# EasyEDA Pro project ProProject_circuller_2023-11-15.epro

# Schematic Schematic1
Create Date: 2023-10-07; Page Name: P1; Project Name: circuller; Schematic Name: Schematic1; Update Date: 2023-10-11; Company: MPAM Lab; Page Size: A3; Version: 0.1
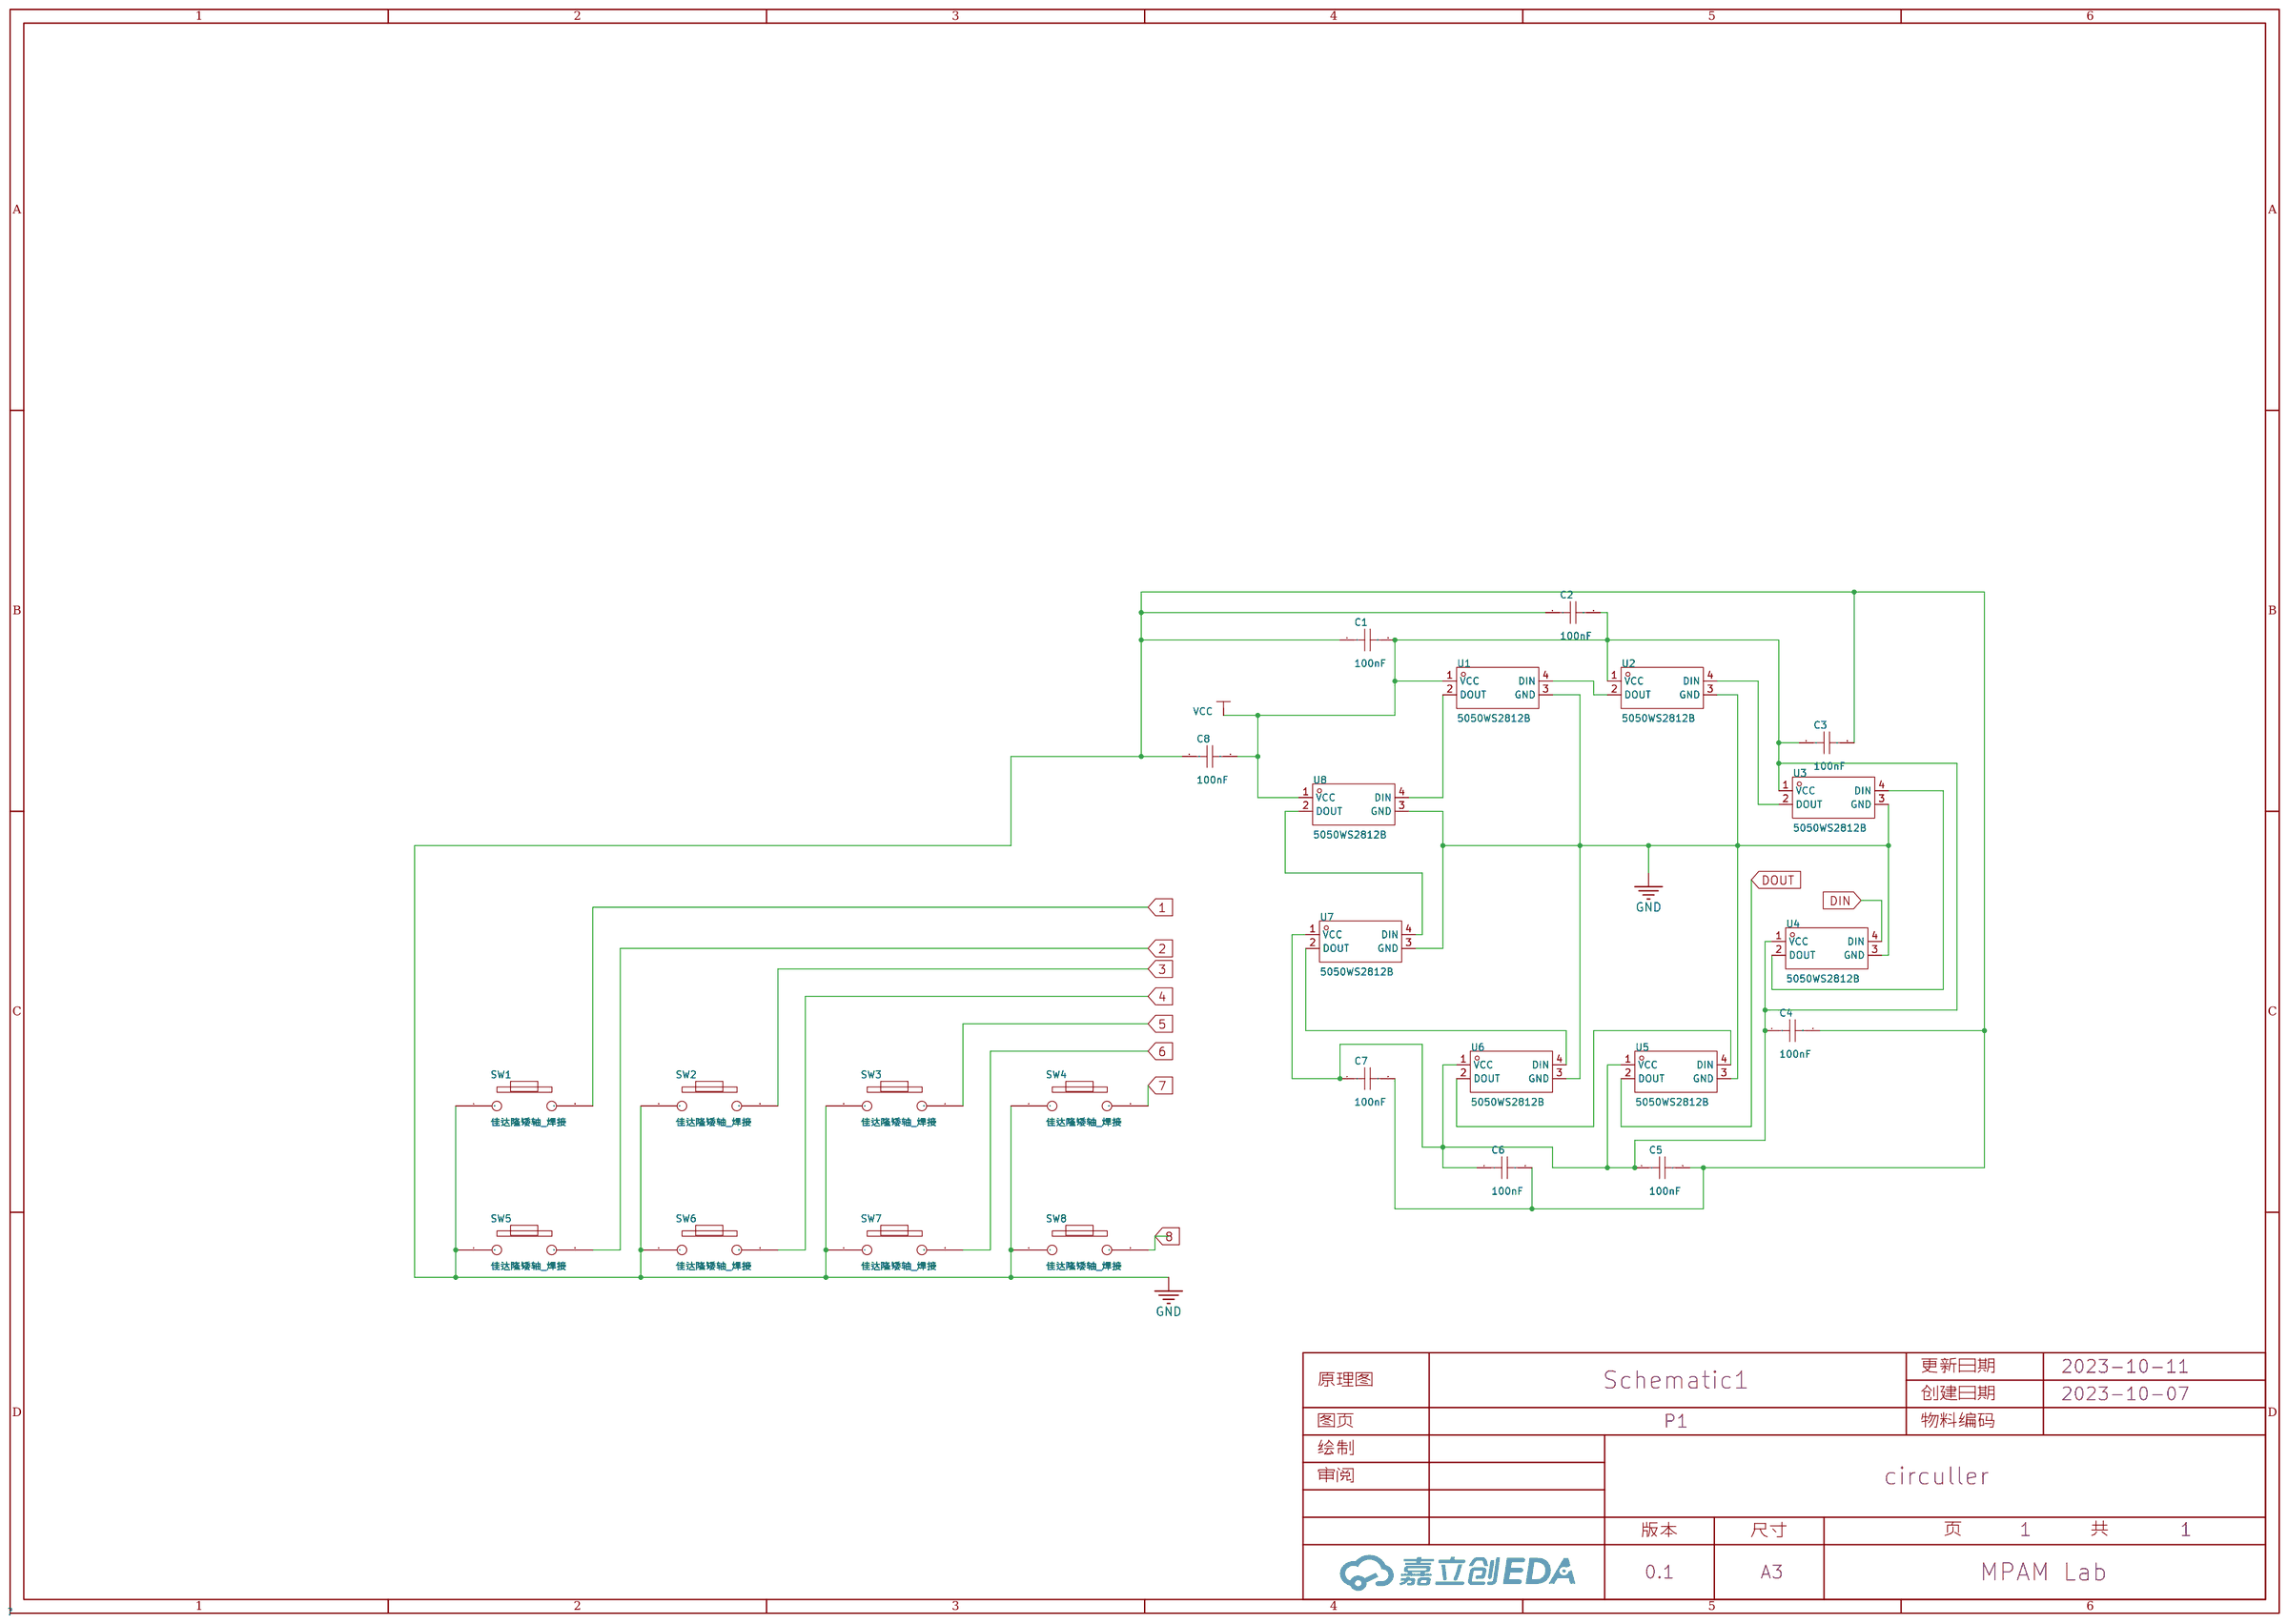
[diagram p0: schematic sheet]

## Parts
C1  100nF  [C0603]
C2  100nF  [C0603]
C3  100nF  [C0603]
C4  100nF  [C0603]
C5  100nF  [C0603]
C6  100nF  [C0603]
C7  100nF  [C0603]
C8  100nF  [C0603]
SW1  佳达隆矮轴_焊接  [佳达隆矮轴焊接]
SW2  佳达隆矮轴_焊接  [佳达隆矮轴焊接]
SW3  佳达隆矮轴_焊接  [佳达隆矮轴焊接]
SW4  佳达隆矮轴_焊接  [佳达隆矮轴焊接]
SW5  佳达隆矮轴_焊接  [佳达隆矮轴焊接]
SW6  佳达隆矮轴_焊接  [佳达隆矮轴焊接]
SW7  佳达隆矮轴_焊接  [佳达隆矮轴焊接]
SW8  佳达隆矮轴_焊接  [佳达隆矮轴焊接]
U1  5050WS2812B  [LED-SMD_5050WS2812B]
U2  5050WS2812B  [LED-SMD_5050WS2812B]
U3  5050WS2812B  [LED-SMD_5050WS2812B]
U4  5050WS2812B  [LED-SMD_5050WS2812B]
U5  5050WS2812B  [LED-SMD_5050WS2812B]
U6  5050WS2812B  [LED-SMD_5050WS2812B]
U7  5050WS2812B  [LED-SMD_5050WS2812B]
U8  5050WS2812B  [LED-SMD_5050WS2812B]

## Library data of the parts
C1-C8 = CAP_0603: Supplier Footprint: 0603
SW1-SW8 = 佳达隆矮轴_焊接: Supplier: eyy
U1-U8 = 5050WS2812B: Supplier Part: C2874876; Supplier Footprint: LED-SMD-4_L5.0-W5.0-P3.20-LS5.4; JLCPCB Part Class: 扩展库; Datasheet: 2021-08-01/763763S/fc73e402754744b5b9326c8825dec5cc/ws2812B.pdf; Supplier: LCSC

## Nets
GND: C1.1 C2.1 C3.2 C4.2 C5.2 C6.2 C7.2 C8.1 SW1.1 SW2.1 SW3.1 SW4.1 SW5.1 SW6.1 SW7.1 SW8.1 U1.3(GND) U2.3(GND) U3.3(GND) U4.3(GND) U5.3(GND) U6.3(GND) U7.3(GND) U8.3(GND)
VCC: C1.2 C2.2 C3.1 C4.1 C5.1 C6.1 C7.1 C8.2 U1.1(VCC) U2.1(VCC) U3.1(VCC) U4.1(VCC) U5.1(VCC) U6.1(VCC) U7.1(VCC) U8.1(VCC)
1: SW1.2
2: SW5.2
3: SW2.2
4: SW6.2
5: SW3.2
6: SW7.2
7: SW4.2
8: SW8.2
DIN: U4.4(DIN)
DOUT: U5.2(DOUT)
$1N1699: U1.2(DOUT) U8.4(DIN)
$1N1729: U1.4(DIN) U2.2(DOUT)
$1N1734: U2.4(DIN) U3.2(DOUT)
$1N1800: U3.4(DIN) U4.2(DOUT)
$1N1842: U6.4(DIN) U7.2(DOUT)
$1N1852: U5.4(DIN) U6.2(DOUT)
$1N6884: U7.4(DIN) U8.2(DOUT)

# Schematic Ver 2
Create Date: 2023-11-13; Page Name: P1; Project Name: circuller; Schematic Name: Ver 2; Update Date: 2023-11-14; Company: MPAM Laboratory; Drawed: FDS; Page Size: A4; Part Number: M-CIR-PCB-1; Reviewed: FDS; Version: V1.0
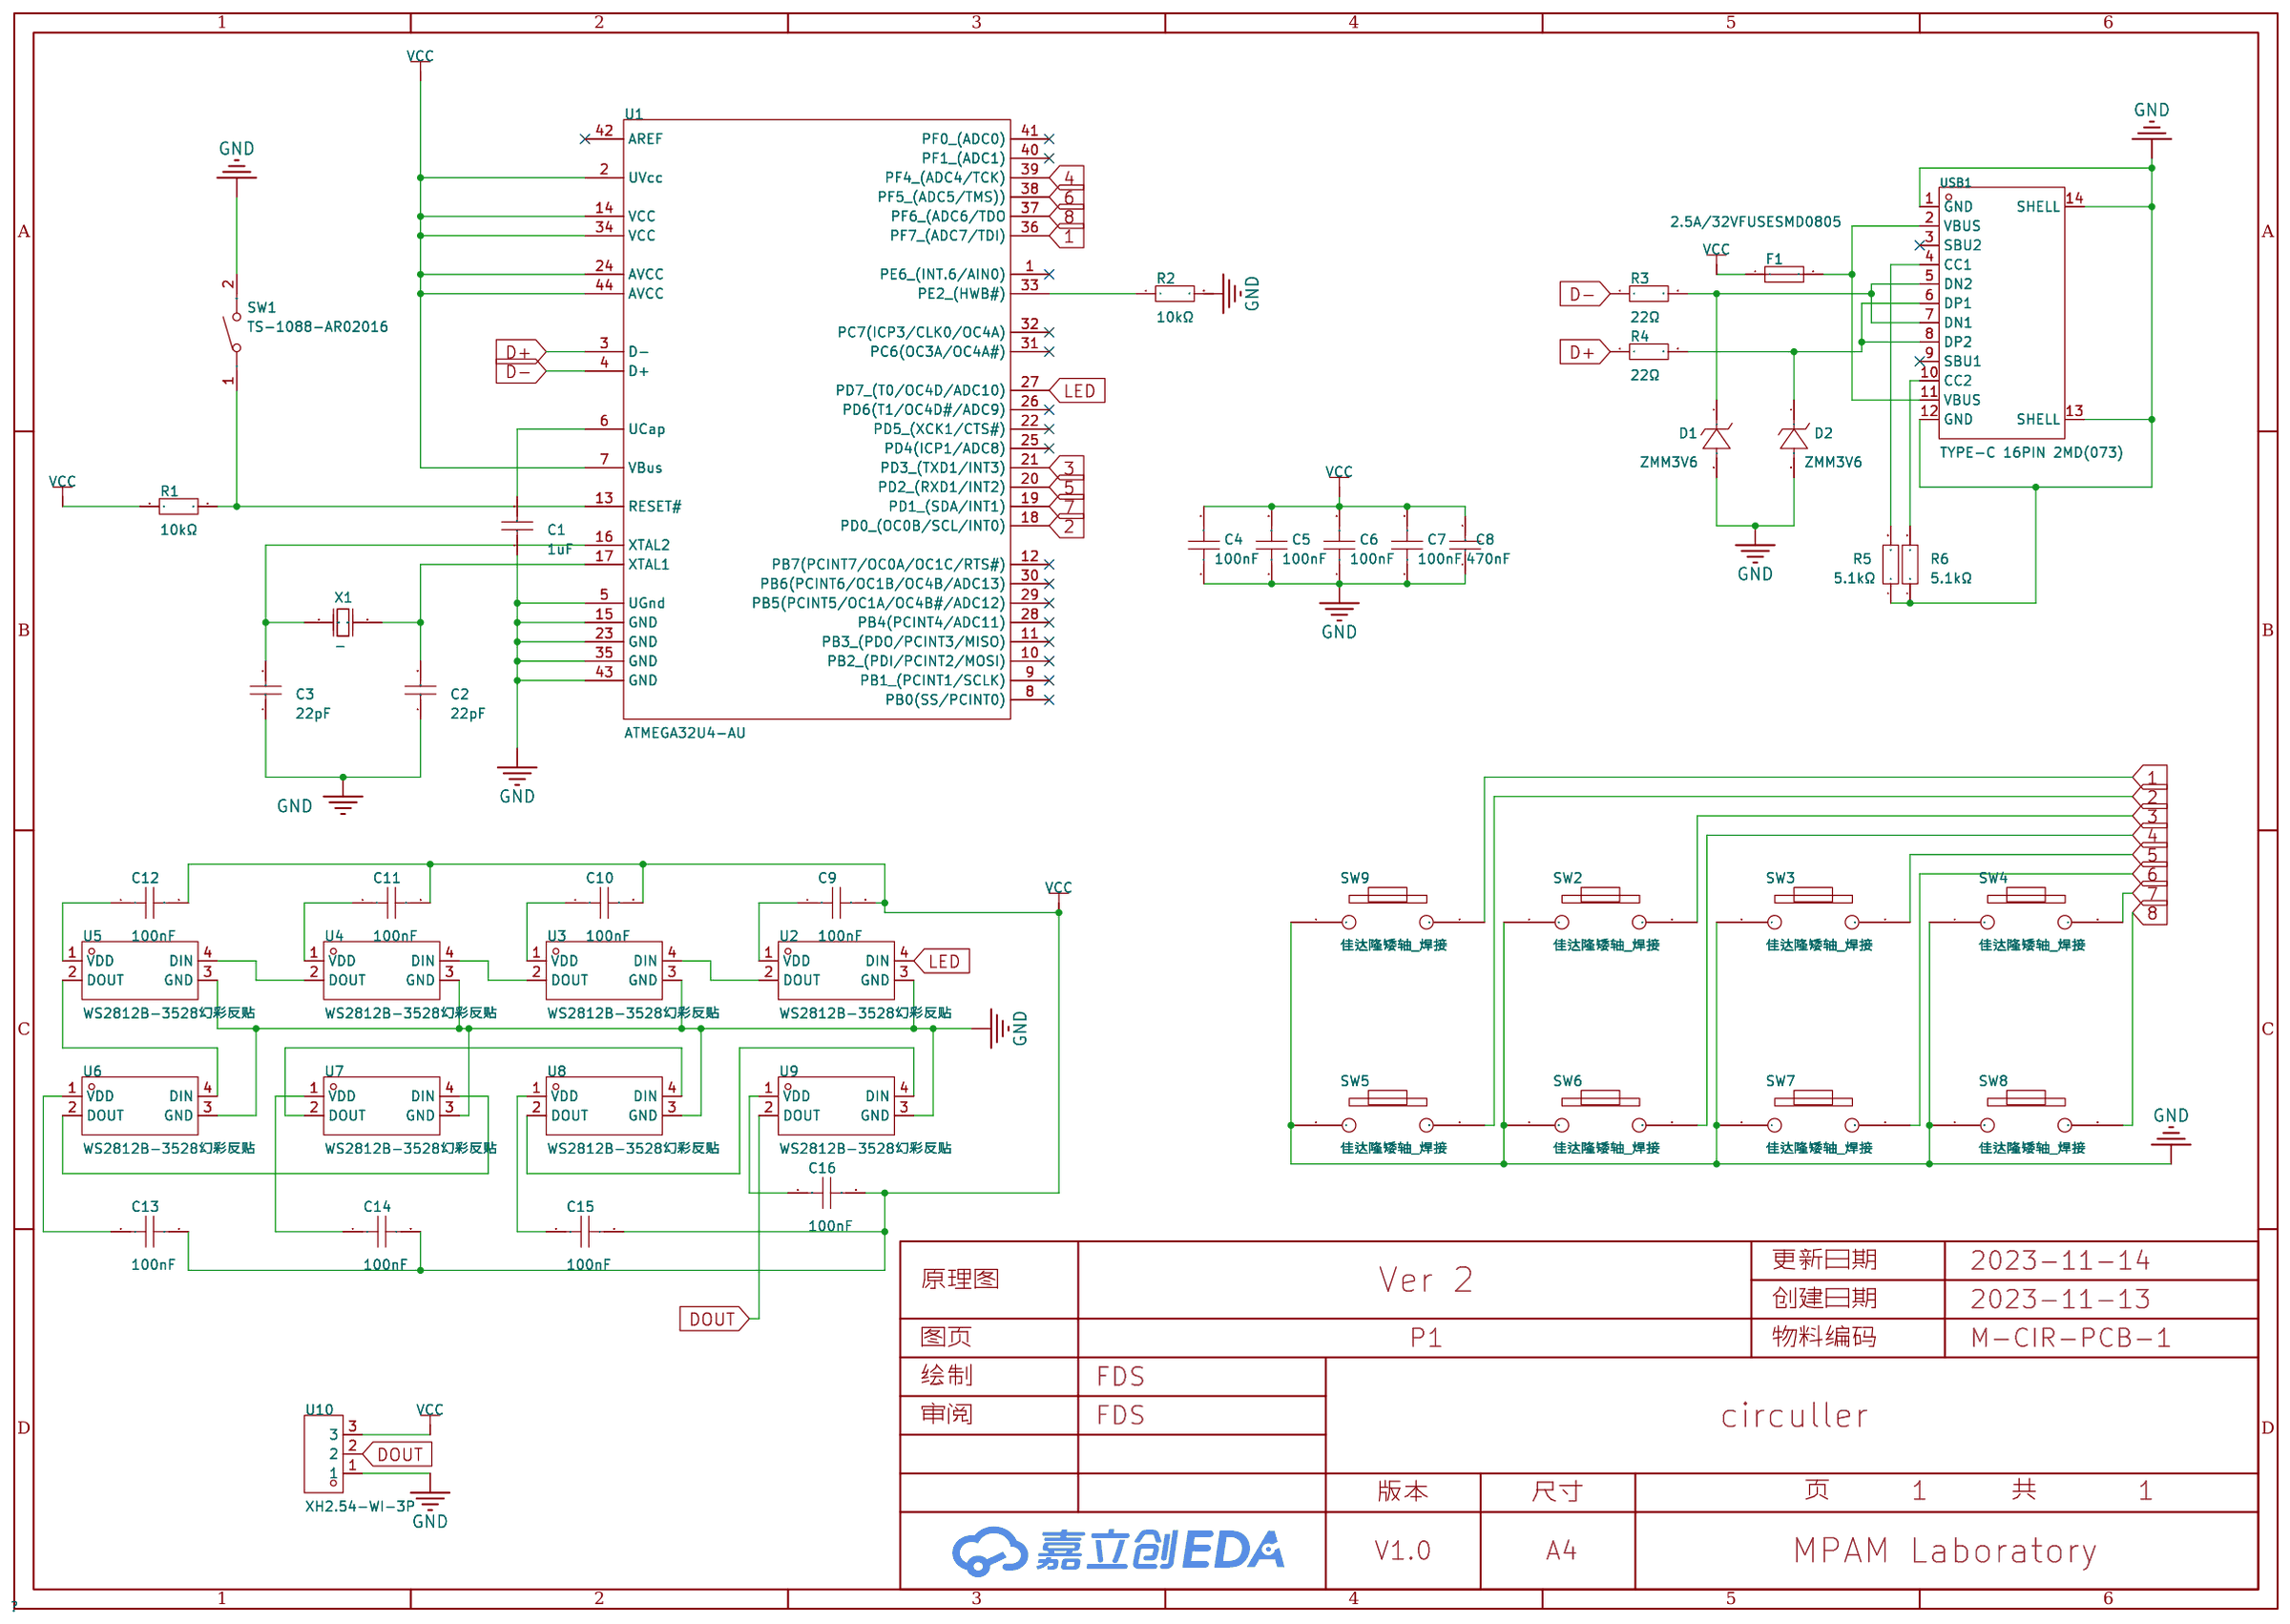
[diagram p1: schematic sheet]

## Parts
C1  1uF  [C0603]
C2  22pF  [C0603]
C3  22pF  [C0603]
C4  100nF  [C0603]
C5  100nF  [C0603]
C6  100nF  [C0603]
C7  100nF  [C0603]
C8  470nF  [C0603]
C9  100nF  [C0603]
C10  100nF  [C0603]
C11  100nF  [C0603]
C12  100nF  [C0603]
C13  100nF  [C0603]
C14  100nF  [C0603]
C15  100nF  [C0603]
C16  100nF  [C0603]
D1  ZMM3V6  [LL-34_L3.5-W1.5-RD]
D2  ZMM3V6  [LL-34_L3.5-W1.5-RD]
F1  2.5A/32VFUSESMD0805  [F0805]
R1  10kΩ  [R0603]
R2  10kΩ  [R0603]
R3  22Ω  [R0603]
R4  22Ω  [R0603]
R5  5.1kΩ  [R0603]
R6  5.1kΩ  [R0603]
SW1  TS-1088-AR02016  [SW-SMD_L3.9-W3.0-P4.45]
SW2  佳达隆矮轴_焊接  [佳达隆矮轴焊接]
SW3  佳达隆矮轴_焊接  [佳达隆矮轴焊接]
SW4  佳达隆矮轴_焊接  [佳达隆矮轴焊接]
SW5  佳达隆矮轴_焊接  [佳达隆矮轴焊接]
SW6  佳达隆矮轴_焊接  [佳达隆矮轴焊接]
SW7  佳达隆矮轴_焊接  [佳达隆矮轴焊接]
SW8  佳达隆矮轴_焊接  [佳达隆矮轴焊接]
SW9  佳达隆矮轴_焊接  [佳达隆矮轴焊接]
U1  ATMEGA32U4-AU  [QFP-44_L10.0-W10.0-P0.80-LS13.2-BL]
U2  WS2812B-3528幻彩反贴  [LED-SMD_L3.2-W2.8-TR]
U3  WS2812B-3528幻彩反贴  [LED-SMD_L3.2-W2.8-TR]
U4  WS2812B-3528幻彩反贴  [LED-SMD_L3.2-W2.8-TR]
U5  WS2812B-3528幻彩反贴  [LED-SMD_L3.2-W2.8-TR]
U6  WS2812B-3528幻彩反贴  [LED-SMD_L3.2-W2.8-TR]
U7  WS2812B-3528幻彩反贴  [LED-SMD_L3.2-W2.8-TR]
U8  WS2812B-3528幻彩反贴  [LED-SMD_L3.2-W2.8-TR]
U9  WS2812B-3528幻彩反贴  [LED-SMD_L3.2-W2.8-TR]
U10  XH2.54-WI-3P  [CONN-TH_XH2.54-WI-3P]
USB1  TYPE-C 16PIN 2MD(073)  [USB-C-SMD_TYPE-C-6PIN-2MD-073]
X1  -  [OSC-SMD_2P-L5.0-W3.2]

## Library data of the parts
C1 = CL10A105KB8NNNC: 容值:1uF;精度:±10%;额定电压:50V;材质(温度系数):X5R;; LCSC Part Name: 1uF ±10% 50V; Supplier Part: C15849; Manufacturer: SAMSUNG(三星); Supplier Footprint: 0603; JLCPCB Part Class: 基础库; Datasheet: https://atta.szlcsc.com/upload/public/pdf/source/20160103/1457707679084.pdf; Supplier: LCSC; Tolerance: ±10%; Voltage Rated: 50V; Temperature Coefficient: X5R
C2 C3 = CL10C220JB8NNNC: 容值:22pF;精度:±5%;额定电压:50V;材质(温度系数):C0G;; LCSC Part Name: 22pF ±5% 50V; Supplier Part: C1653; Manufacturer: SAMSUNG(三星); Supplier Footprint: 0603; JLCPCB Part Class: 基础库; Datasheet: https://atta.szlcsc.com/upload/public/pdf/source/20160218/1457707763339.pdf; Supplier: LCSC; Tolerance: ±5%; Voltage Rated: 50V; Temperature Coefficient: C0G
C4-C7 = CC0603KRX7R9BB104: 容值:100nF;精度:±10%;额定电压:50V;材质(温度系数):X7R;; LCSC Part Name: 100nF ±10% 50V; Supplier Part: C14663; Manufacturer: YAGEO(国巨); Supplier Footprint: 0603; JLCPCB Part Class: 基础库; Datasheet: https://atta.szlcsc.com/upload/public/pdf/source/20180910/C282072_33301C7F631E79921B82A8DAC6BCC5B3.pdf; Supplier: LCSC; Tolerance: ±10%; Voltage Rated: 50V; Temperature Coefficient: X7R
C8 = CL10B474KA8NNNC: 容值:470nF;精度:±10%;额定电压:25V;材质(温度系数):X7R;; LCSC Part Name: 470nF ±10% 25V; Supplier Part: C1623; Manufacturer: SAMSUNG(三星); Supplier Footprint: 0603; JLCPCB Part Class: 基础库; Datasheet: https://atta.szlcsc.com/upload/public/pdf/source/20160218/1457707763339.pdf; Supplier: LCSC; Tolerance: ±10%; Voltage Rated: 25V; Temperature Coefficient: X7R
C9-C16 = CC0603KRX7R9BB104: 容值:100nF;精度:±10%;额定电压:50V;材质(温度系数):X7R;; LCSC Part Name: 100nF ±10% 50V; Supplier Part: C14663; Manufacturer: YAGEO(国巨); Supplier Footprint: 0603; JLCPCB Part Class: Basic Part; Datasheet: https://atta.szlcsc.com/upload/public/pdf/source/20180910/C282072_33301C7F631E79921B82A8DAC6BCC5B3.pdf; Supplier: LCSC; Tolerance: ±10%; Voltage Rated: 50V; Temperature Coefficient: X7R; Check: true
D1 D2 = ZMM3V6: 稳压值(标称值):-;精度:-;功率:500mW;反向电流(Ir):2uA@1V;; LCSC Part Name: 500mW; Supplier Part: C707190; Manufacturer: Slkor(萨科微); Supplier Footprint: LL-34; JLCPCB Part Class: 扩展库; Datasheet: https://atta.szlcsc.com/upload/public/pdf/source/20200721/C707184_776B95022AAA01ECB528B9CFDAFDB27C.pdf; Supplier: LCSC; Power Dissipation: 500mW; Reverse Leakage Current (Ir): 2uA@1V
F1 = 2.5A/32VFUSESMD0805: Supplier Part: C9900004266; JLCPCB Part Class: 扩展库; Datasheet: https://atta.szlcsc.comnull; Supplier: LCSC
R1 R2 = 0603WAF1002T5E: 电阻类型:厚膜电阻;阻值:10kΩ;精度:±1%;功率:100mW;; LCSC Part Name: 厚膜电阻 10kΩ ±1% 100mW; Supplier Part: C25804; Manufacturer: UNI-ROYAL(厚声); Supplier Footprint: 0603; JLCPCB Part Class: 基础库; Datasheet: https://atta.szlcsc.com/upload/public/pdf/source/20200306/C422600_1E6D84923E4A46A82E41ADD87F860B5C.pdf; Supplier: LCSC; Type: 厚膜电阻; Tolerance: ±1%; Power(Watts): 100mW; Temperature Coefficient: ±100ppm/℃; Overload Voltage (Max): 75V; Operating Temperature Range: -55℃~+155℃
R3 R4 = 0603WAF220JT5E: 电阻类型:厚膜电阻;阻值:22Ω;精度:±1%;功率:100mW;温度系数:±100ppm/℃;; LCSC Part Name: 厚膜电阻 22Ω ±1% 100mW; Supplier Part: C23345; Manufacturer: UNI-ROYAL(厚声); Supplier Footprint: 0603; JLCPCB Part Class: 基础库; Datasheet: https://atta.szlcsc.com/upload/public/pdf/source/20200306/C422600_1E6D84923E4A46A82E41ADD87F860B5C.pdf; Supplier: LCSC; Type: 厚膜电阻; Tolerance: ±1%; Power(Watts): 100mW; Temperature Coefficient: ±100ppm/℃; Overload Voltage (Max): 75V; Operating Temperature Range: -55℃~+155℃
R5 R6 = 0603WAF5101T5E: 电阻类型:厚膜电阻;阻值:5.1kΩ;精度:±1%;功率:100mW;温度系数:±100ppm/℃;; LCSC Part Name: 厚膜电阻 5.1kΩ ±1% 100mW; Supplier Part: C23186; Manufacturer: UNI-ROYAL(厚声); Supplier Footprint: 0603; JLCPCB Part Class: 基础库; Datasheet: https://atta.szlcsc.com/upload/public/pdf/source/20200306/C422600_1E6D84923E4A46A82E41ADD87F860B5C.pdf; Supplier: LCSC; Type: 厚膜电阻; Tolerance: ±1%; Power(Watts): 100mW; Temperature Coefficient: ±100ppm/℃; Overload Voltage (Max): 75V; Operating Temperature Range: -55℃~+155℃
SW1 = TS-1088-AR02016: 触点电流:50mA;额定电压(DC):12V;绝缘电阻:100MΩ;电路结构:单刀单掷;安装方式:立贴;作用力:160gf@±50gf;机械寿命:10万次;带支架:否;; LCSC Part Name: 4*3*2mm 立贴 轻触开关; Supplier Part: C720477; Manufacturer: XUNPU(讯普); Supplier Footprint: SMD; JLCPCB Part Class: 扩展库; Datasheet: https://atta.szlcsc.com/upload/public/pdf/source/20200810/C720475_60D09DD6C54279ADDB2DC25100F1CC11.pdf; Supplier: LCSC; Contact Current: 50mA; Voltage Rating (DC): 12V; Insulation Resistance: 100MΩ; Circuit: 单刀单掷; Mounting Style: 立贴; Actuator Style: 圆形按钮; Actuator/Cap Color: 黑色; Operating Force: 160gf@±50gf; Mechanical Life: 10万次; Operating Temperature: -30℃~+80℃; Pin Style: SMD接片; Switch Length: 4mm; Switch Width: 3mm; Switch Height: 2mm; Strike Gundam: 否
SW2-SW9 = 佳达隆矮轴_焊接: Supplier: eyy
U1 = ATMEGA32U4-AU: CPU内核:AVR;CPU最大主频:16MHz;工作电压范围:2.7V~5.5V;程序存储容量:32KB;程序存储器类型:FLASH;RAM总容量:2.5KB;GPIO端口数量:26;; Supplier Part: C44854; Manufacturer: MICROCHIP(美国微芯); Supplier Footprint: QFP-44(10x10); JLCPCB Part Class: 扩展库; Datasheet: https://atta.szlcsc.com/upload/public/pdf/source/20150407/1457707275091.pdf; Supplier: LCSC; CPU Core: AVR; CPU Maximum Speed: 16MHz; Operating Voltage Range: 2.7V~5.5V; Program Storage Size: 32KB; Program Memory Type: FLASH; RAM Size: 2.5KB; EEPROM: 1KB; GPIO Ports Number: 26; ADC (Bit): 10bit; Universal Serial Bus: 有; Peripheral/Function: 看门狗；PWM; Watchdog: 有; Low-Voltage Detect: 有; Internal Oscillator: 有; Operating Temperature Range: -40℃~+85℃
U2-U9 = WS2812B-3528幻彩反贴: Supplier Part: C9900004451; Supplier Footprint: LED-SMD; JLCPCB Part Class: 扩展库; Datasheet: 2021-12-21/757506A/9376501e0a854f2f817213720825c541/WS2812B-3528幻彩反贴.pdf; Supplier: LCSC
U10 = XH2.54-WI-3P: Supplier Part: C9900005531; Supplier Footprint: XH2.54MM-3P; JLCPCB Part Class: 扩展库; Supplier: LCSC
USB1 = TYPE-C 16PIN 2MD(073): 连接器类型:Type-C;标准:-;公母:母座;触点数量:16;端口数量:1;安装方式:卧贴;额定电流 - 电源:5A;工作温度范围:-25℃~+85℃;; LCSC Part Name: TYPE-C母座 16P 4脚插件带定位柱 不锈钢外壳 2次模顶; Supplier Part: C2765186; Manufacturer: SHOU HAN(首韩); Supplier Footprint: SMD; JLCPCB Part Class: 扩展库; Supplier: LCSC; Connector Type: Type-C; Gender: 母座; Number of Contacts: 16; Number of Ports: 1; Mounting Style: 卧贴; Current Rating - Power (Max): 5A; Operating Temperature Range: -25℃~+85℃
X1 = XSHEELNANF-16MHZ: 频率:-;负载电容:-;; LCSC Part Name: 16MHz 20pF ±30PPM -40℃ ~+85℃; Supplier Part: C242221; Manufacturer: TAITIEN(泰艺电子); Supplier Footprint: SMD5032-2P; JLCPCB Part Class: 扩展库; Datasheet: https://atta.szlcsc.com/upload/public/pdf/source/20180704/C242221_71476AA24F58019514D39B5873D4BE18.pdf; Supplier: LCSC

## Nets
GND: C1.1 C2.1 C3.1 C4.1 C5.1 C6.1 C7.1 C8.1 D1.2(A) D2.2(A) R2.2 R5.1 R6.1 SW1.2 SW2.1 SW3.1 SW4.1 SW5.1 SW6.1 SW7.1 SW8.1 SW9.1 U1.5(UGnd) U1.15(GND) U1.23(GND) U1.35(GND) U1.43(GND) U2.3(GND) U3.3(GND) U4.3(GND) U5.3(GND) U6.3(GND) U7.3(GND) U8.3(GND) U9.3(GND) U10.1 USB1.1(GND) USB1.12(GND) USB1.13(SHELL) USB1.14(SHELL)
VCC: C4.2 C5.2 C6.2 C7.2 C8.2 C9.2 C10.2 C11.2 C12.2 C13.2 C14.2 C15.2 C16.2 F1.1 R1.1 U1.2(UVcc) U1.7(VBus) U1.14(VCC) U1.24(AVCC) U1.34(VCC) U1.44(AVCC) U10.3
1: SW9.2 U1.36(PF7 (ADC7/TDI))
2: SW5.2 U1.18(PD0 (OC0B/SCL/INT0))
3: SW2.2 U1.21(PD3 (TXD1/INT3))
4: SW6.2 U1.39(PF4 (ADC4/TCK))
5: SW3.2 U1.20(PD2 (RXD1/INT2))
6: SW7.2 U1.38(PF5 (ADC5/TMS)))
7: SW4.2 U1.19(PD1 (SDA/INT1))
8: SW8.2 U1.37(PF6 (ADC6/TDO)
D+: R4.1 U1.3(D-)
D-: R3.1 U1.4(D+)
DOUT: U9.2(DOUT) U10.2
LED: U1.27(PD7 (T0/OC4D/ADC10)) U2.4(DIN)
$1N992: C2.2 U1.17(XTAL1) X1.2(OSC2)
$1N1040: C3.2 U1.16(XTAL2) X1.1(OSC1)
$1N1214: R1.2 SW1.1 U1.13(RESET#)
$1N1318: R2.1 U1.33(PE2 (HWB#))
$1N2823: F1.2 USB1.2(VBUS) USB1.11(VBUS)
$1N3423: D1.1(K) R3.2 USB1.5(DN2) USB1.7(DN1)
$1N3438: D2.1(K) R4.2 USB1.6(DP1) USB1.8(DP2)
$1N3472: R5.2 USB1.4(CC1)
$1N3479: R6.2 USB1.10(CC2)
$1N3933: U2.2(DOUT) U3.4(DIN)
$1N3938: U3.2(DOUT) U4.4(DIN)
$1N3943: U4.2(DOUT) U5.4(DIN)
$1N3948: U5.2(DOUT) U6.4(DIN)
$1N3953: U6.2(DOUT) U7.4(DIN)
$1N3959: U7.2(DOUT) U8.4(DIN)
$1N3965: U8.2(DOUT) U9.4(DIN)
$1N4279: C9.1 U2.1(VDD)
$1N4296: C10.1 U3.1(VDD)
$1N4306: C11.1 U4.1(VDD)
$1N4316: C12.1 U5.1(VDD)
$1N4320: C13.1 U6.1(VDD)
$1N4353: C16.1 U9.1(VDD)
$1N4416: C14.1 U7.1(VDD)
$1N4551: C15.1 U8.1(VDD)
$1N4867: C1.2 U1.6(UCap)

Not connected (* = marked no-connect by the designer): U1 1(PE6 (INT.6/AIN0))* 8(PB0(SS/PCINT0))* 9(PB1 (PCINT1/SCLK))* 10(PB2 (PDI/PCINT2/MOSI))* 11(PB3 (PDO/PCINT3/MISO))* 12(PB7(PCINT7/OC0A/OC1C/RTS#))* 22(PD5 (XCK1/CTS#))* 25(PD4(ICP1/ADC8))* 26(PD6(T1/OC4D#/ADC9))* 28(PB4(PCINT4/ADC11))* 29(PB5(PCINT5/OC1A/OC4B#/ADC12))* 30(PB6(PCINT6/OC1B/OC4B/ADC13))* 31(PC6(OC3A/OC4A#))* 32(PC7(ICP3/CLK0/OC4A))* 40(PF1 (ADC1))* 41(PF0 (ADC0))* 42(AREF)*; USB1 3(SBU2)* 9(SBU1)*

# Board PCB5
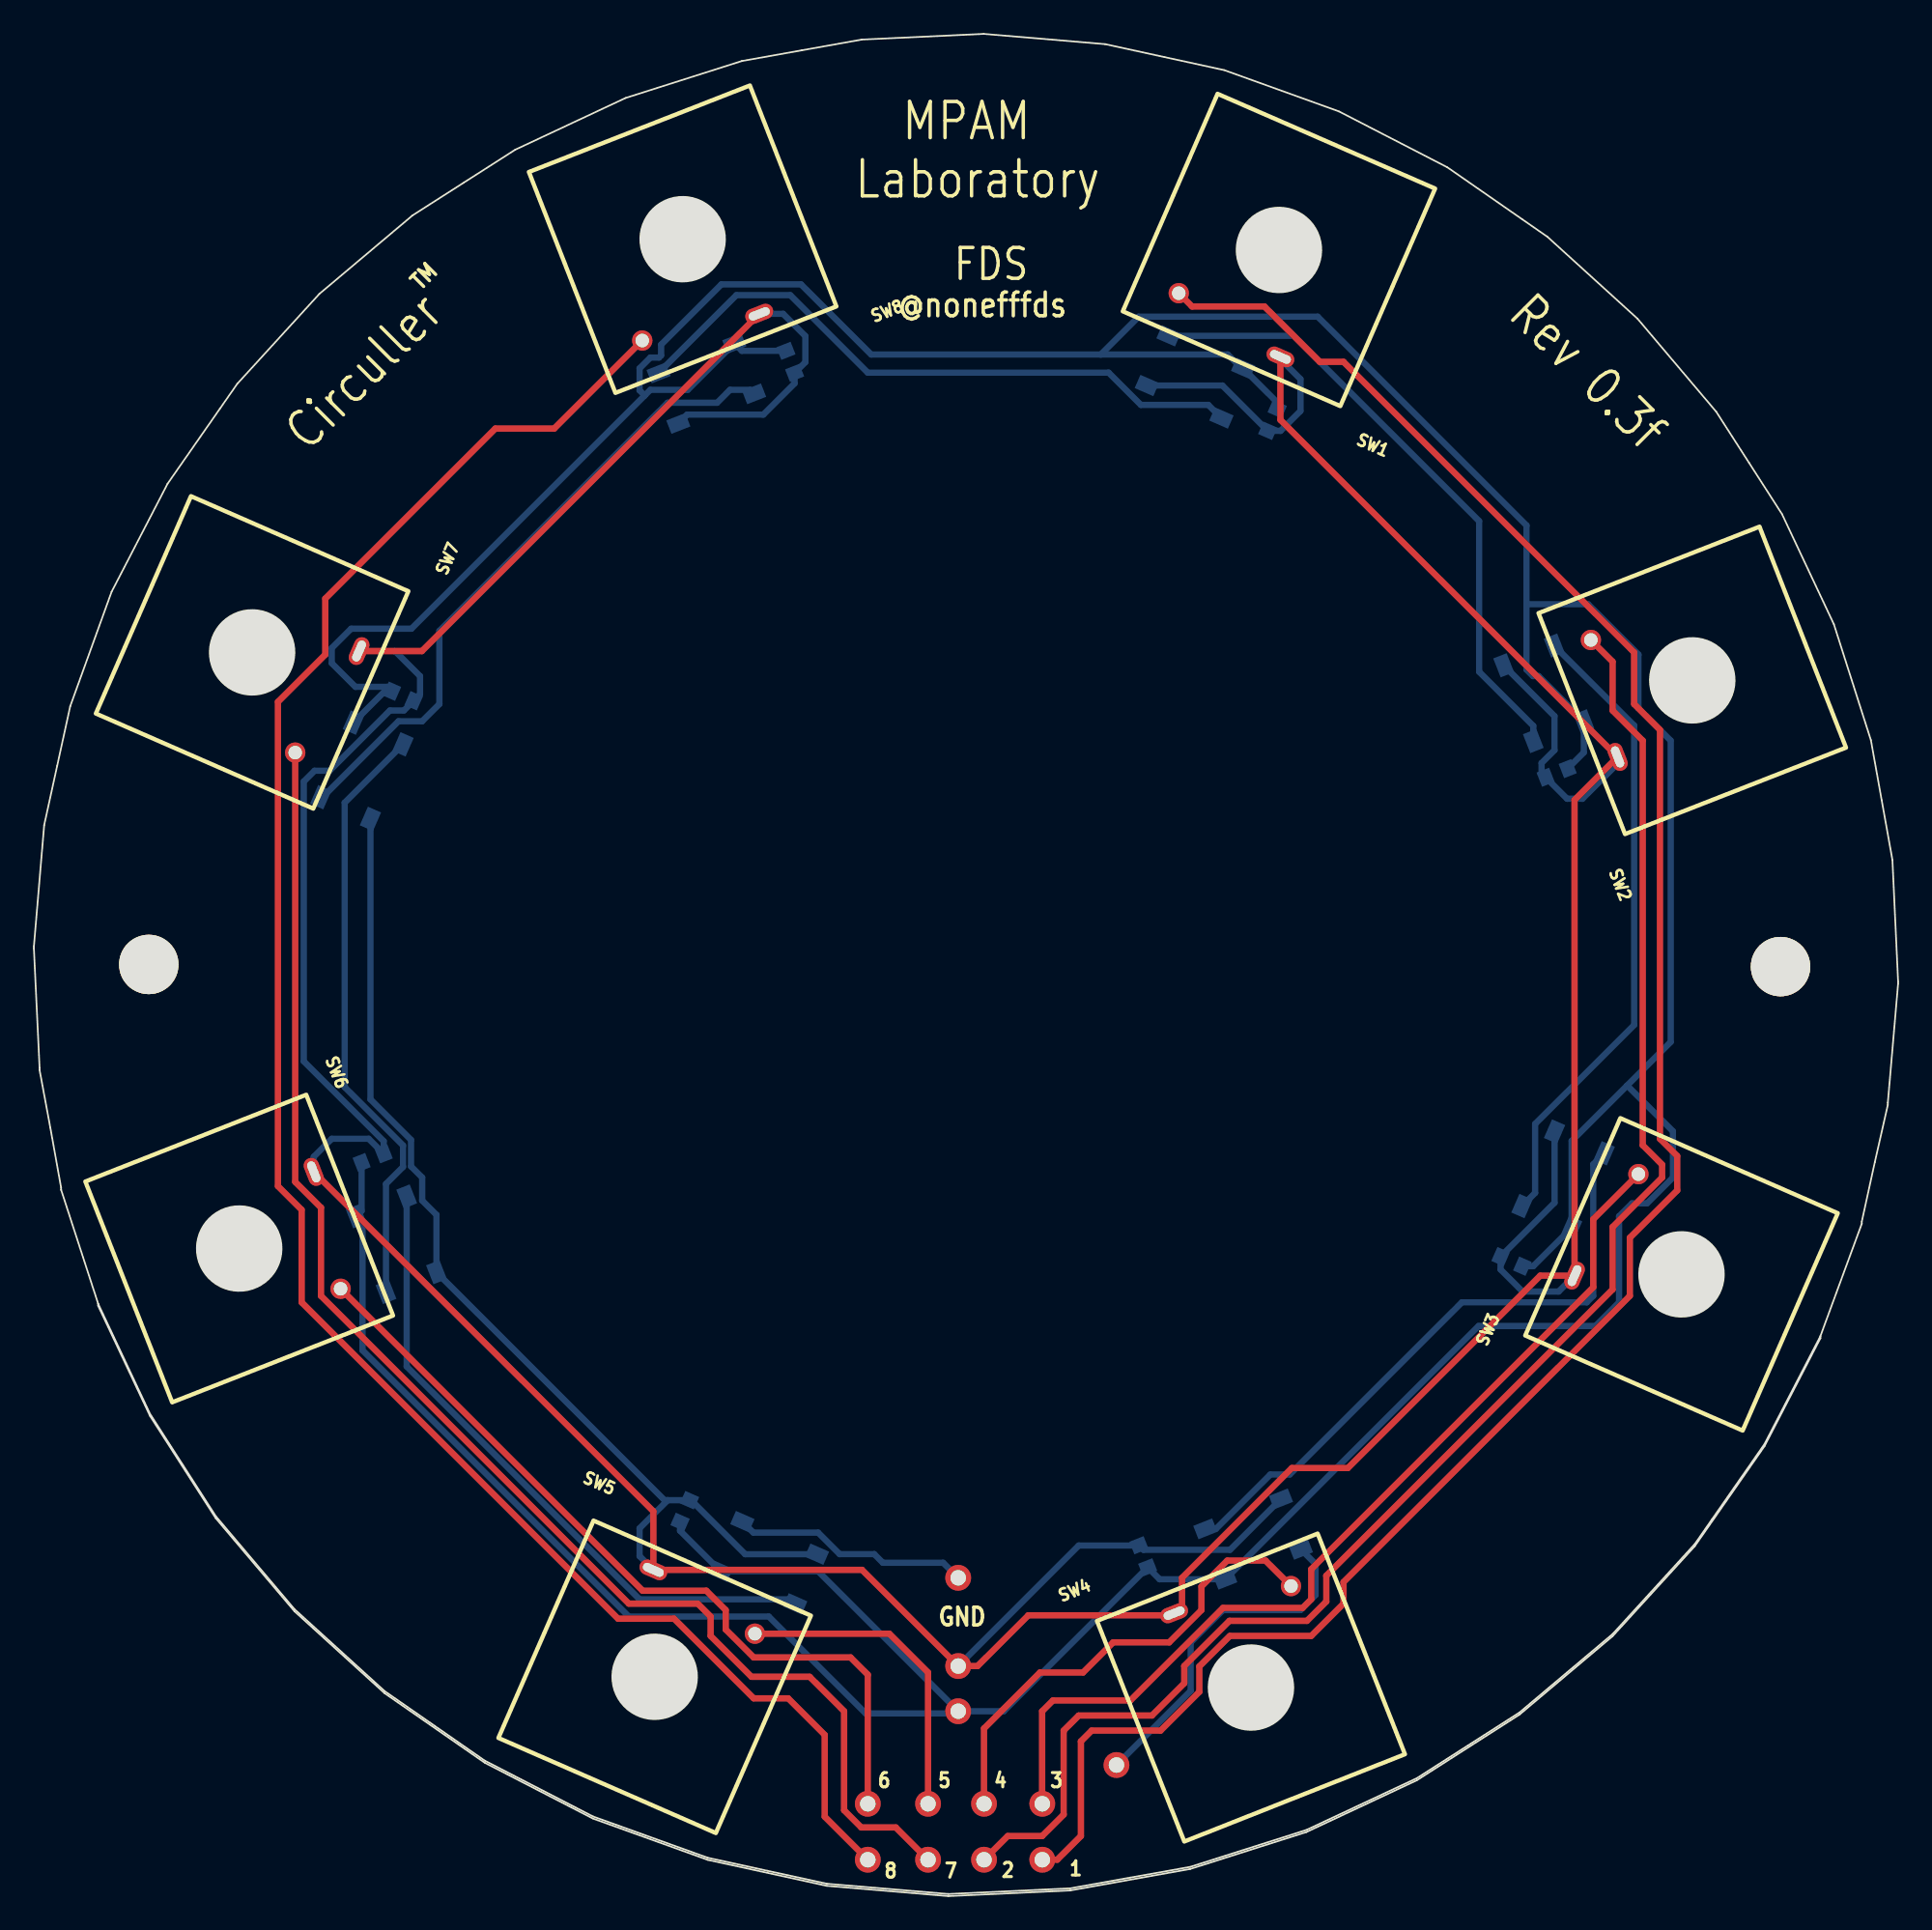
[diagram p2: board, top side]
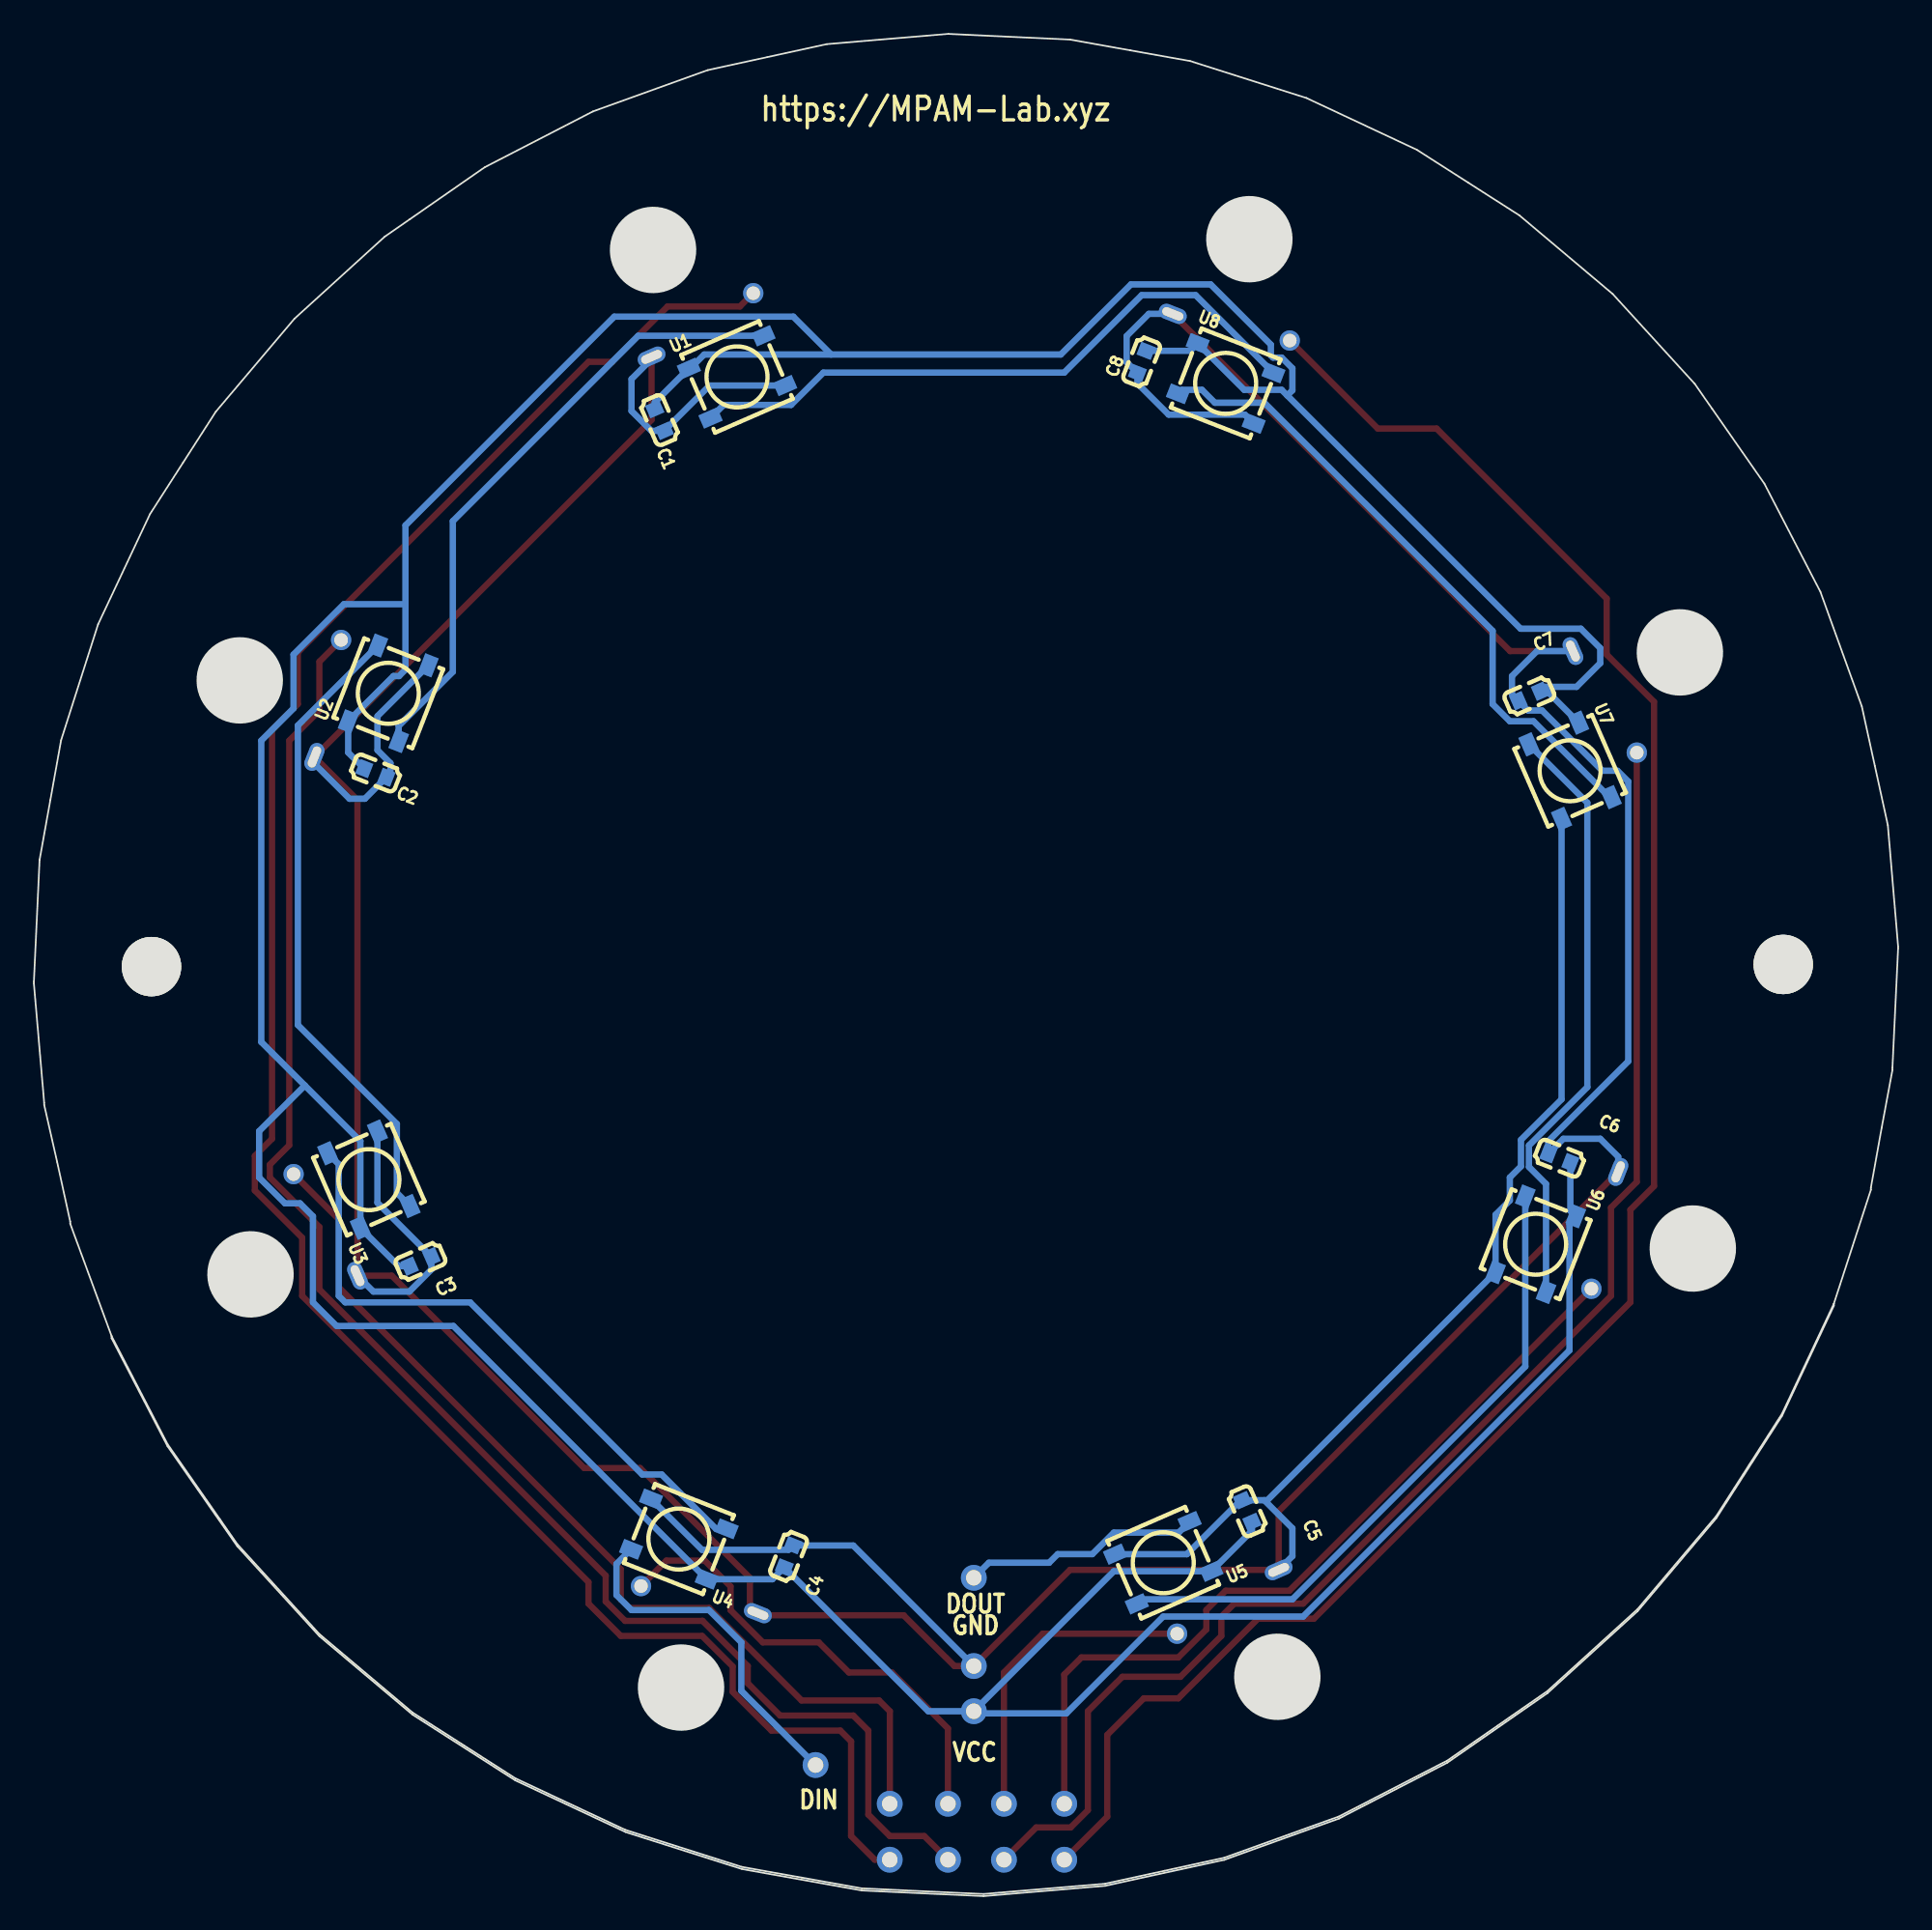
[diagram p3: board, bottom side, seen from below]

Outline 109.98 x 109.89 mm; copper layers: Top Layer, Bottom Layer. Coordinates in mm from the lower left corner of the outline.
Outline path: 3.79,34.96 1.6,41.68 1.6,41.81 0.97,45.34 0.33,48.75 0.33,48.87 0,55.92 0,56.05 0.61,63.2 1.37,66.71 2.14,70.22 4.58,76.97 7.89,83.35 12,89.24 16.84,94.55 22.34,99.18 25.37,101.12 28.39,103.06 34.91,106.11 41.76,108.29 45.3,108.93 48.84,109.56 56.03,109.89 63.2,109.29 66.71,108.52 70.23,107.75 76.99,105.32 83.38,102.02 89.29,97.92 94.61,93.08 99.25,87.6 101.19,84.58 103.13,81.55 106.19,75.05 108.38,68.21 109.01,64.68 109.65,61.14 109.98,53.97 109.98,53.85 109.37,46.82 109.37,46.69 108.61,43.31 107.84,39.8 107.84,39.68 105.4,33.05 ; 3.79,34.96 3.79,34.84 6.85,28.34 10.73,22.3 15.37,16.81 20.69,11.97 26.6,7.87 32.99,4.57 39.75,2.14 46.78,0.61 53.95,0 61.14,0.33 68.22,1.6 75.07,3.78 81.59,6.84 87.64,10.71 93.14,15.34 97.98,20.65 102.09,26.54 105.4,32.92 105.4,33.05 ; 3.79,34.96 6.85,28.46 8.79,25.44 10.73,22.42 15.37,16.93 20.69,12.1 23.64,10.05 26.6,8 32.99,4.7 39.75,2.26 43.27,1.5 46.78,0.73 53.95,0.12 61.14,0.46 64.68,1.09 68.22,1.73 75.07,3.91 81.59,6.96 84.61,8.9 87.64,10.83 93.14,15.47 97.98,20.77 102.09,26.67 105.4,33.05
Stack: Top Layer 0.035mm - / Dielectric1 0.91mm FR4 er 4.5 / Bottom Layer 0.035mm -

## Design rules (mm)
template: JLCPCB Capability(Two Layers Board)
spacing copperThickness1oz (default): track to track 0.102, other pairs 0.152 to 0.3
spacing copperThickness2oz: track to track 0.203, other pairs 0.152 to 0.3
track width copperThickness1oz (default): min 0.127, default 0.254, max 2.54
track width copperThickness2oz: min 0.203, default 0.254, max 2.54
differential pair differentialPair (default): width min 0.127, default 0.254, max 2.54; gap min 0.152, default 0.152
via viaSize (default): diameter min 0.5, default 0.61, max 10; hole min 0.3, default 0.305, max 6.3

## Placement (name value [footprint] x y rotation side)
C1  100nF  [C0603]  73.07 87.11 66.5 bottom
C2  100nF  [C0603]  89.84 66.28 21.4 bottom
C3  100nF  [C0603]  87.17 37.45 156.4 bottom
C4  100nF  [C0603]  65.45 20.05 111.6 bottom
C5  100nF  [C0603]  38.4 22.72 66.4 bottom
C6  100nF  [C0603]  19.99 43.55 21.5 bottom
C7  100nF  [C0603]  21.76 70.82 336.4 bottom
C8  100nF  [C0603]  44.62 90.54 111.4 bottom
NOREF  -  [Pad_e284]  54.53 13.58 0 top
NOREF#2  -  [Pad_e819]  6.78 54.98 0 top
NOREF#3  -  [Pad_e277]  52.75 2.15 0 top
NOREF#4  -  [Pad_e280]  49.2 5.45 0 top
NOREF#5  -  [Pad_e279]  59.49 2.15 0 top
NOREF#6  -  [Pad_e1166]  63.87 7.74 0 top
NOREF#7  -  [Pad_e278]  56.05 2.15 0 top
NOREF#8  -  [Pad_e282]  56.05 5.45 0 top
NOREF#9  -  [Pad_e820]  103.04 54.85 0 top
NOREF#10  -  [Pad_e281]  52.75 5.45 0 top
NOREF#11  -  [Pad_e1124]  54.53 10.91 0 top
NOREF#12  -  [Pad_e1160]  54.53 18.78 0 top
NOREF#13  -  [Pad_e283]  59.49 5.45 0 top
NOREF#14  -  [Pad_e276]  49.2 2.15 0 top
SW1  佳达隆矮轴_焊接  [佳达隆矮轴焊接]  73.45 97.14 156.5 top
SW2  佳达隆矮轴_焊接  [佳达隆矮轴焊接]  97.84 71.74 111.4 top
SW3  佳达隆矮轴_焊接  [佳达隆矮轴焊接]  97.2 36.69 66.4 top
SW4  佳达隆矮轴_焊接  [佳达隆矮轴焊接]  71.8 12.31 21.6 top
SW5  佳达隆矮轴_焊接  [佳达隆矮轴焊接]  36.62 12.94 336.4 top
SW6  佳达隆矮轴_焊接  [佳达隆矮轴焊接]  12.11 38.22 291.5 top
SW7  佳达隆矮轴_焊接  [佳达隆矮轴焊接]  12.87 73.39 246.4 top
SW8  佳达隆矮轴_焊接  [佳达隆矮轴焊接]  38.27 97.78 201.4 top
U1  5050WS2812B  [LED-SMD_5050WS2812B]  68.5 89.65 156.5 bottom
U2  5050WS2812B  [LED-SMD_5050WS2812B]  89.07 70.98 111.4 bottom
U3  5050WS2812B  [LED-SMD_5050WS2812B]  90.22 42.28 66.4 bottom
U4  5050WS2812B  [LED-SMD_5050WS2812B]  71.93 21.07 21.6 bottom
U5  5050WS2812B  [LED-SMD_5050WS2812B]  43.35 19.67 336.4 bottom
U6  5050WS2812B  [LED-SMD_5050WS2812B]  21.38 38.47 291.5 bottom
U7  5050WS2812B  [LED-SMD_5050WS2812B]  19.35 66.41 246.4 bottom
U8  5050WS2812B  [LED-SMD_5050WS2812B]  39.67 89.27 201.4 bottom

## Footprints (pads in the part's own frame, mm; a bottom-side part is the same pattern mirrored in y, then rotated)
C0603
  rect 0.8x0.9 smd: 1(-0.7,0) 2(0.7,0)
LED-SMD_5050WS2812B
  rect 1.2x0.85 smd: 1(-2.4,1.6) 2(-2.4,-1.6) 3(2.4,-1.6) 4(2.4,1.6)
Pad_e276
  round 1.524 hole 0.914: 1(0,0)
Pad_e277
  round 1.524 hole 0.914: 2(0,0)
Pad_e278
  round 1.524 hole 0.914: 3(0,0)
Pad_e279
  round 1.524 hole 0.914: 4(0,0)
Pad_e280
  round 1.524 hole 0.914: 5(0,0)
Pad_e281
  round 1.524 hole 0.914: 6(0,0)
Pad_e282
  round 1.524 hole 0.914: 7(0,0)
Pad_e283
  round 1.524 hole 0.914: 8(0,0)
Pad_e284
  round 1.524 hole 0.914: 9(0,0)
Pad_e819
  round 3.5 hole 3.5: 13(0,0)
Pad_e820
  round 3.5 hole 3.5: 14(0,0)
Pad_e1124
  round 1.524 hole 0.914: 10(0,0)
Pad_e1160
  round 1.524 hole 0.914: 11(0,0)
Pad_e1166
  round 1.524 hole 0.914: 12(0,0)
佳达隆矮轴焊接
  oval 1.7x0.9 hole 1.3x0.5: 1(-2.6,5.75)
  round 1.2 hole 0.8: 2(4.4,4.7)

## Nets
GND: C1.1 C2.1 C3.2 C4.2 C5.2 C6.2 C7.2 C8.1 NOREF.9 SW1.1 SW2.1 SW3.1 SW4.1 SW5.1 SW6.1 SW7.1 SW8.1 U1.3 U2.3 U3.3 U4.3 U5.3 U6.3 U7.3 U8.3
VCC: C1.2 C2.2 C3.1 C4.1 C5.1 C6.1 C7.1 C8.2 NOREF#11.10 U1.1 U2.1 U3.1 U4.1 U5.1 U6.1 U7.1 U8.1
1: NOREF#5.4 SW1.2
2: NOREF#10.6 SW5.2
3: NOREF#7.3 SW2.2
4: NOREF#4.5 SW6.2
5: NOREF#13.8 SW3.2
6: NOREF#3.2 SW7.2
7: NOREF#8.7 SW4.2
8: NOREF#14.1 SW8.2
DIN: NOREF#6.12 U4.4
DOUT: NOREF#12.11 U5.2
$1N1699: U1.2 U8.4
$1N1729: U1.4 U2.2
$1N1734: U2.4 U3.2
$1N1800: U3.4 U4.2
$1N1842: U6.4 U7.2
$1N1852: U5.4 U6.2
$1N6884: U7.4 U8.2

Pads without a net: NOREF#2 13; NOREF#9 14

## Via types
v1: diameter 0.61, hole 0.305, Top Layer to Bottom Layer, 1 via

## Routing (per net, layer and track width the routed paths; a pad name or vN(x,y) marks a point on that pad's centre or on a via; arc(x,y) is an arc through that point)
GND: length 382.3
  Top Layer w0.37: 73.37,90.67 73.54,90.83 73.54,87.12 SW2.1 90.89,64.69 SW3.1 88.87,36.61 77.52,25.26 74.21,25.26 67.74,18.78 67.74,17.16 SW4.1 67.14,16.57 58.67,16.57 55.67,13.58 v1(54.53,13.58) 48.85,19.25 36.54,19.25 36.54,22.71 SW6.1 ; SW8.1 22.89,73.47 SW7.1
  Bottom Layer w0.37: 37.39,23.36 35.73,21.71 35.73,20.06 36.54,19.25 ; 37.39,23.36 C5.2 38.78,23.36 41.96,20.18 46.19,20.18 ; 37.39,23.36 37.21,23.36 U6.3 23.75,40.21 22.91,41.05 22.91,42.41 22.25,43.06 22.25,44.63 19.85,47.02 19.85,63.57 ; U4.3 70.57,20.44 65.46,20.44 C4.2 65.18,20.69 61.64,20.69 v1(54.53,13.58) ; U1.3 70.12,89.14 C1.1 73.55,86.47 74.72,87.64 74.72,89.52 73.54,90.71 73.54,90.83 ; 44.88,89.89 45.51,90.52 45.51,92.06 44.2,93.37 SW8.1 ; SW2.1 93.43,66.83 91.36,64.76 90.45,64.76 88.95,66.26 88.95,66.86 89.71,67.62 89.71,69.63 U2.3 ; 89.71,45.12 89.71,40.92 C3.2 86.53,36.98 87.83,35.68 89.95,35.68 SW3.1 ; U8.3 38.54,87.43 43.03,87.43 44.88,89.27 44.88,89.89 ; SW6.1 16.51,43.63 17.57,44.69 19.75,44.69 20.64,43.81 20.64,44.55 15.92,49.26 15.92,65.77 16.56,66.41 17.45,66.41 21,69.97 21.83,69.97 C7.2 22.78,70.92 22.78,72 21.3,73.47 SW7.1
VCC: length 325.9
  Bottom Layer w0.37: NOREF#11.10 46.27,19.17 U5.1 38.12,21.56 C5.1 ; NOREF#11.10 57.22,10.91 C4.1 66.41,18.7 U4.1 85.23,33.64 92.12,33.64 93.52,35.04 93.52,40.12 94.28,40.88 95.17,40.88 96.69,42.41 96.69,45.14 94,47.84 ; NOREF#11.10 54.4,10.78 49.07,10.78 43.35,16.5 35.1,16.5 19.39,32.21 19.39,39.65 19.02,40.02 U6.1 19.33,40.44 C6.1 ; C1.2 73.35,88.15 U1.1 71.25,90.16 70.43,90.97 62.94,90.97 ; 88.06,76.24 91.69,76.24 94.66,73.27 94.66,70.09 96.57,68.19 96.57,50.41 94,47.84 ; 88.06,76.24 88.06,80.89 75.74,93.21 65.18,93.21 62.94,90.97 ; 88.06,76.24 88.06,72.38 88.44,72 88.77,72 U2.1 91.44,67.49 90.49,66.54 ; C3.1 88.45,37.17 90.72,39.44 90.72,44.56 94,47.84 ; 62.94,90.97 49.4,90.97 45.26,95.11 40.56,95.11 37,91.56 37,90.92 36.88,90.79 36.37,90.79 35.73,90.16 35.73,88.86 36.04,88.56 ; 18.85,69.25 20.7,71.1 C7.1 20.86,71.36 18.97,71.36 17.57,72.76 17.57,73.65 18.72,74.79 22.27,74.79 36.04,88.56 ; 36.04,88.56 36.37,88.89 38.58,88.89 U8.1 41.76,91.19 44.37,91.19
1: length 129.2
  Top Layer w0.37: SW1.2 68.33,93.81 72.6,93.81 75.87,90.54 77.26,90.54 94.41,73.39 94.41,70.35 95.93,68.82 95.93,44.69 96.95,43.68 96.95,41.64 94.15,38.85 94.15,35.42 77.26,18.53 77.26,17.26 75.36,15.36 70.56,15.36 68.75,13.55 68.75,12.05 66.47,9.77 62.4,9.77 61.77,9.13 61.77,3.54 60.37,2.15 NOREF#5.4
2: length 18.9
  Top Layer w0.37: 42.54,15.49 50.46,15.49 52.75,13.2 NOREF#10.6
3: length 96.7
  Top Layer w0.37: 91.86,74.13 93.14,72.85 93.14,69.97 94.92,68.19 94.92,44.31 96.06,43.17 96.06,42.41 93.14,39.49 93.14,35.8 76.25,18.91 76.25,17.39 75.1,16.24 70.53,16.24 67.86,13.58 67.86,12.56 65.96,10.66 61.64,10.66 60.75,9.77 60.75,4.81 59.48,3.54 57.45,3.54 NOREF#7.3
4: length 48.8
  Top Layer w0.37: SW6.2 35.91,18.02 39.67,18.02 40.81,16.88 40.81,15.74 42.46,14.09 48.18,14.09 49.2,13.07 NOREF#4.5
5: length 57.2
  Top Layer w0.37: NOREF#13.8 59.48,5.46 59.48,10.91 60.12,11.55 64.69,11.55 70.15,17.01 74.85,17.01 75.36,17.51 75.36,19.29 91.99,35.93 91.99,39.94 SW3.2
6: length 86.4
  Top Layer w0.37: NOREF#3.2 50.85,4.05 48.81,4.05 47.8,5.07 47.8,10.91 45.77,12.94 42.34,12.94 39.92,15.36 39.92,16.5 39.16,17.26 35.1,17.26 16.94,35.42 16.94,40.63 15.42,42.15 SW7.2
7: length 28.1
  Top Layer w0.37: NOREF#8.7 56.05,9.89 59.36,13.2 61.9,13.2 63.67,14.97 66.98,14.97 68.88,16.88 68.88,18.28 70.4,19.8 72.66,19.8 SW4.2
8: length 118.1
  Top Layer w0.37: NOREF#14.1 46.66,4.69 46.66,9.51 44.5,11.67 42.46,11.67 37.77,16.37 34.46,16.37 15.79,35.04 15.79,40.5 14.4,41.9 14.4,70.47 17.19,73.27 17.19,76.57 27.22,86.6 30.69,86.6 SW8.2
DIN: length 20.6
  Bottom Layer w0.37: NOREF#6.12 68.25,12.11 68.25,14.97 70.15,16.88 74.72,16.88 75.61,17.77 75.61,19.6 U4.4
DOUT: length 14.1
  Bottom Layer w0.37: NOREF#12.11 53.64,19.67 50.08,19.67 49.58,20.18 47.54,20.18 46.27,21.45 42.45,21.45 U5.2
$1N1699: length 38.1
  Bottom Layer w0.37: U1.2 69.29,88 65.31,88 63.4,89.9 49.2,89.9 44.62,94.48 41.44,94.48 36.85,89.88
$1N1729: length 37.2
  Bottom Layer w0.37: 88.46,68.16 88.46,69.06 85.26,72.25 85.26,81.14 74.33,92.08 U1.4
$1N1734: length 37.8
  Bottom Layer w0.37: 89.69,73.8 94.41,69.08 94.41,51.41 88.57,45.57 88.57,41.5 87.79,40.72
$1N1800: length 37.3
  Bottom Layer w0.37: U3.4 91.99,43.19 91.99,35.42 91.61,35.04 84.25,35.04 74.09,24.88 72.94,24.88 69.74,21.67 U4.2
$1N1842: length 35.6
  Bottom Layer w0.37: 21.78,67.97 18.33,64.52 18.33,47.74 21.78,44.3 21.78,43.03 20.77,42.03 U6.4
$1N1852: length 38.8
  Bottom Layer w0.37: U5.4 44.64,17.51 35.73,17.51 21.99,31.25 U6.2
$1N6884: length 38.1
  Bottom Layer w0.37: U8.2 42.25,88.89 41.07,88.89 40.31,88.13 37.38,88.13 23.92,74.66 23.92,70.35 22.91,69.33 21.51,69.33 17.03,64.85 U7.4

## Text on the board
Bottom Silkscreen Layer: VCC | GND | DOUT | DIN | https://MPAM-Lab.xyz
Top Silkscreen Layer: 6 | 8 | 5 | 7 | 4 | 2 | 3 | 1 | TM | GND | @nonefffds | FDS | Circuller | Rev 0.3f | MPAM / Laboratory

# Board PCB6
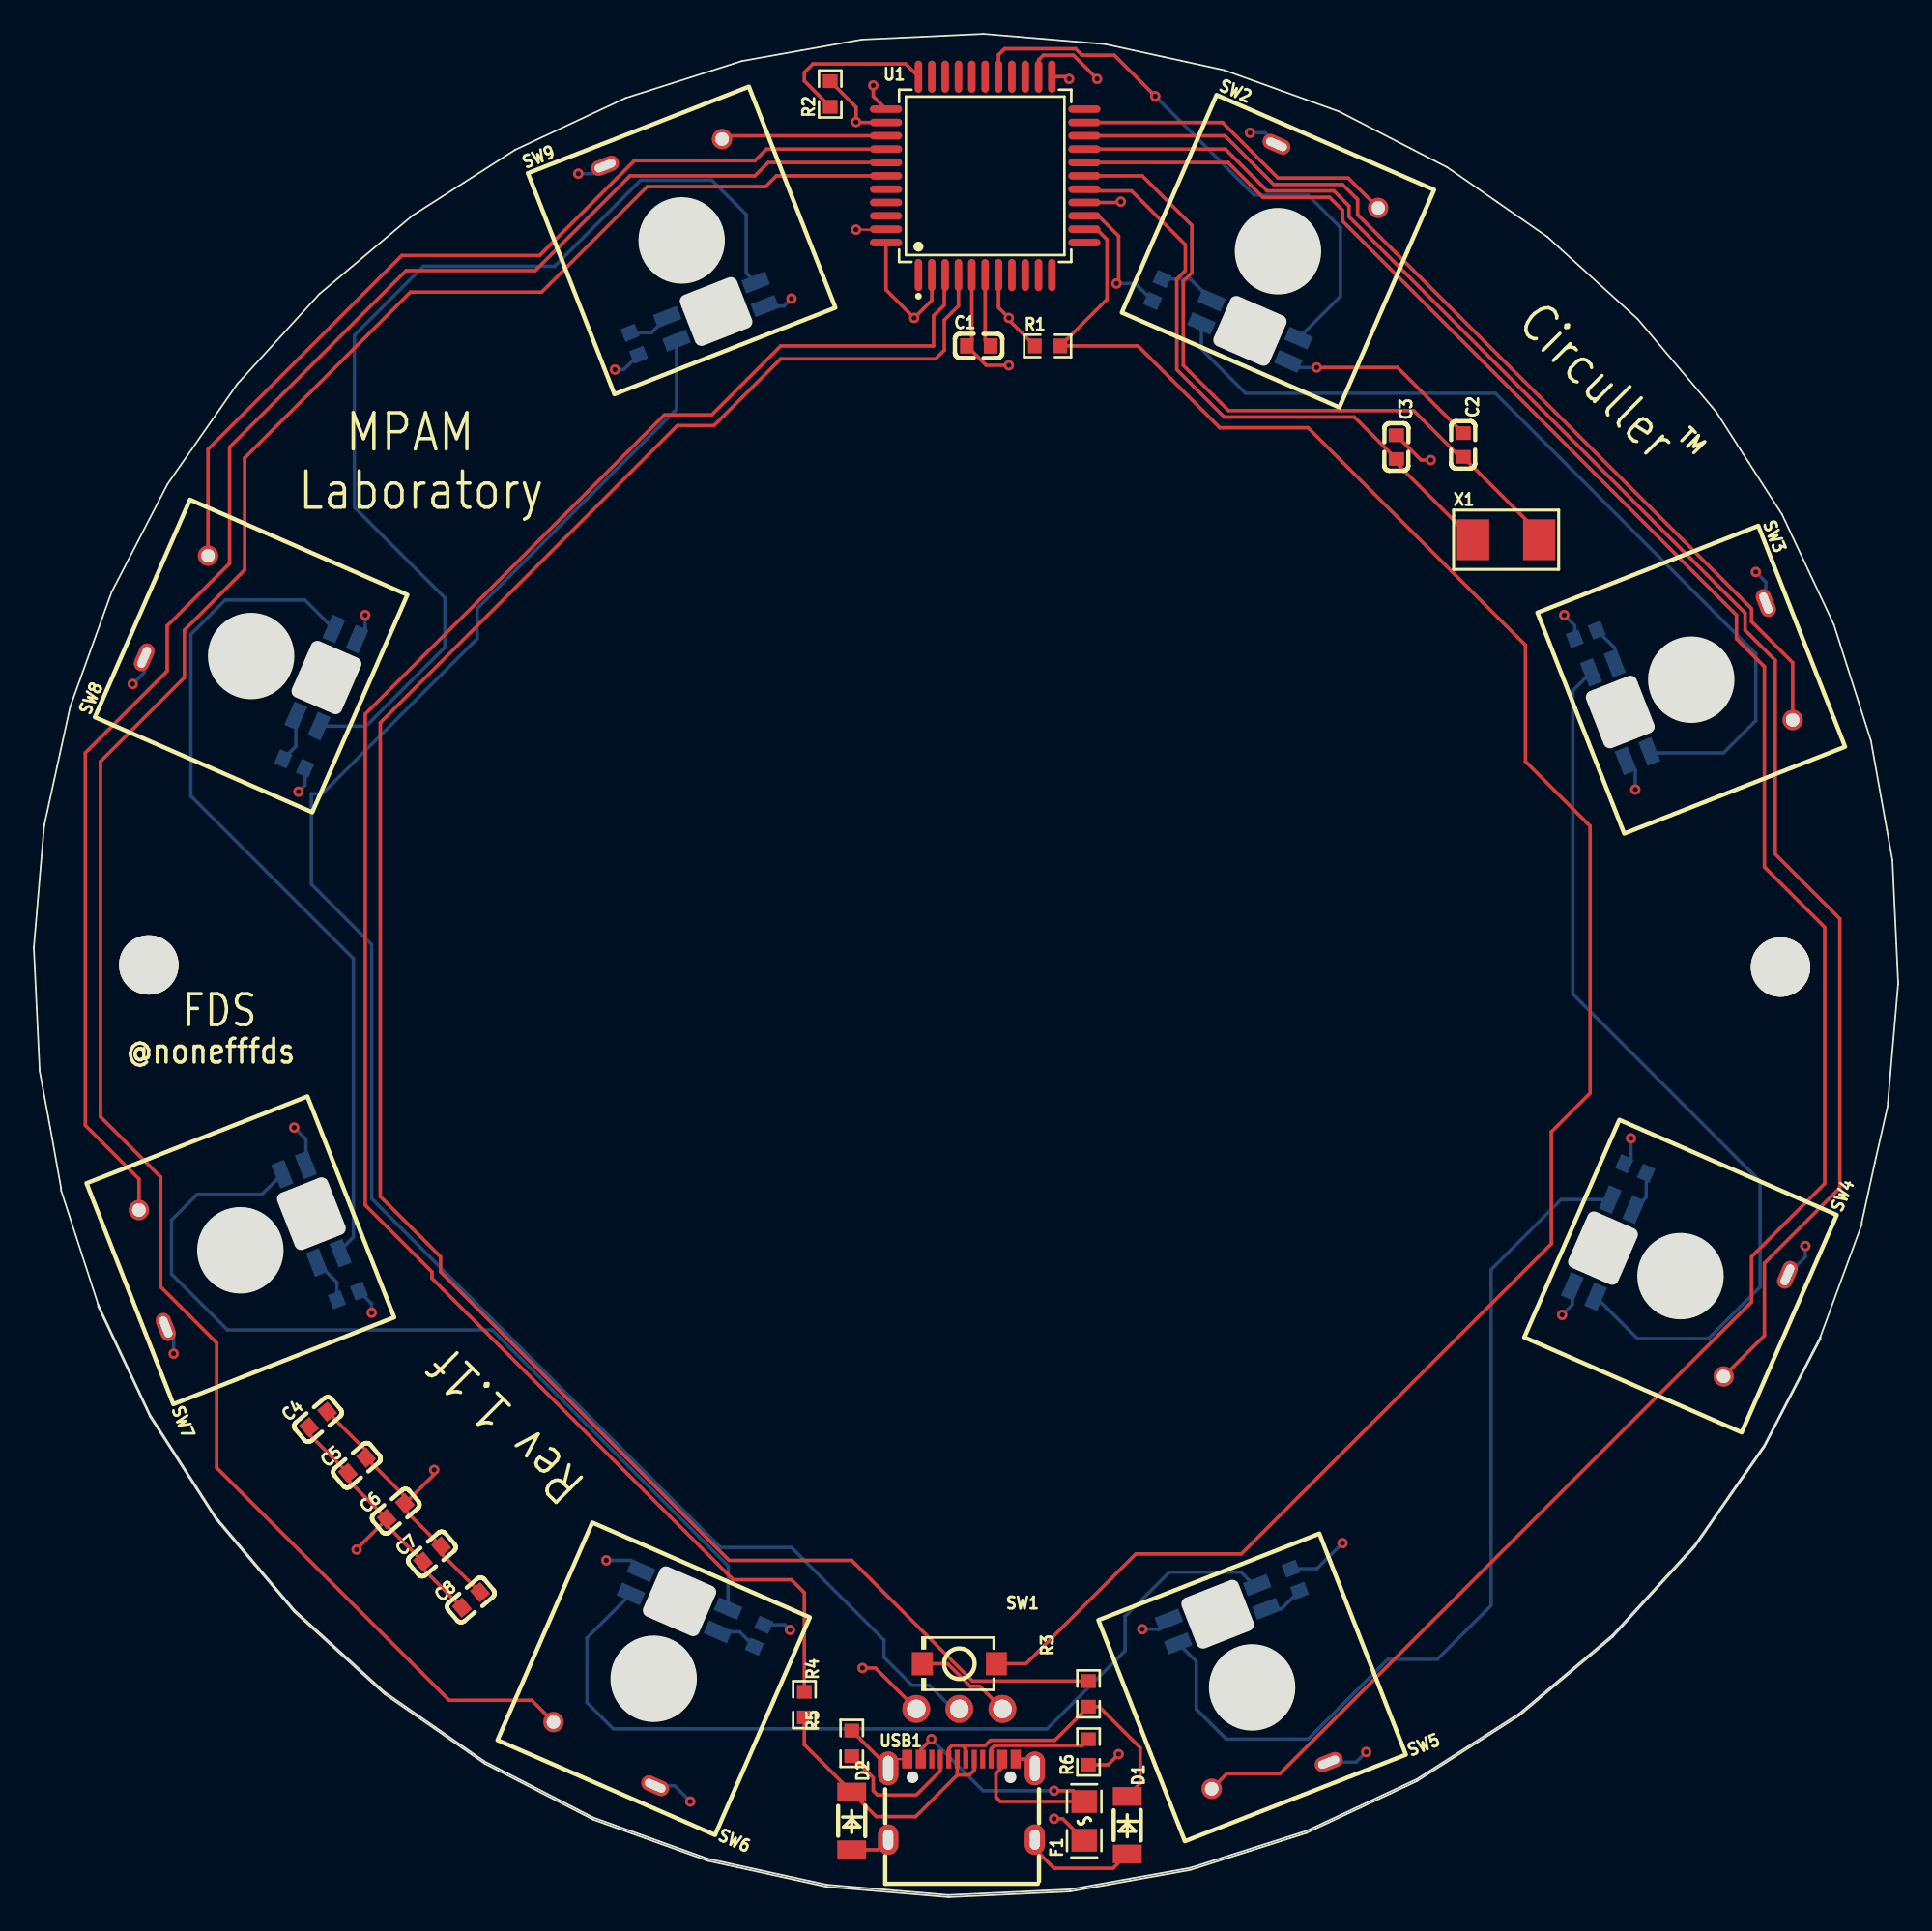
[diagram p4: board, top side]
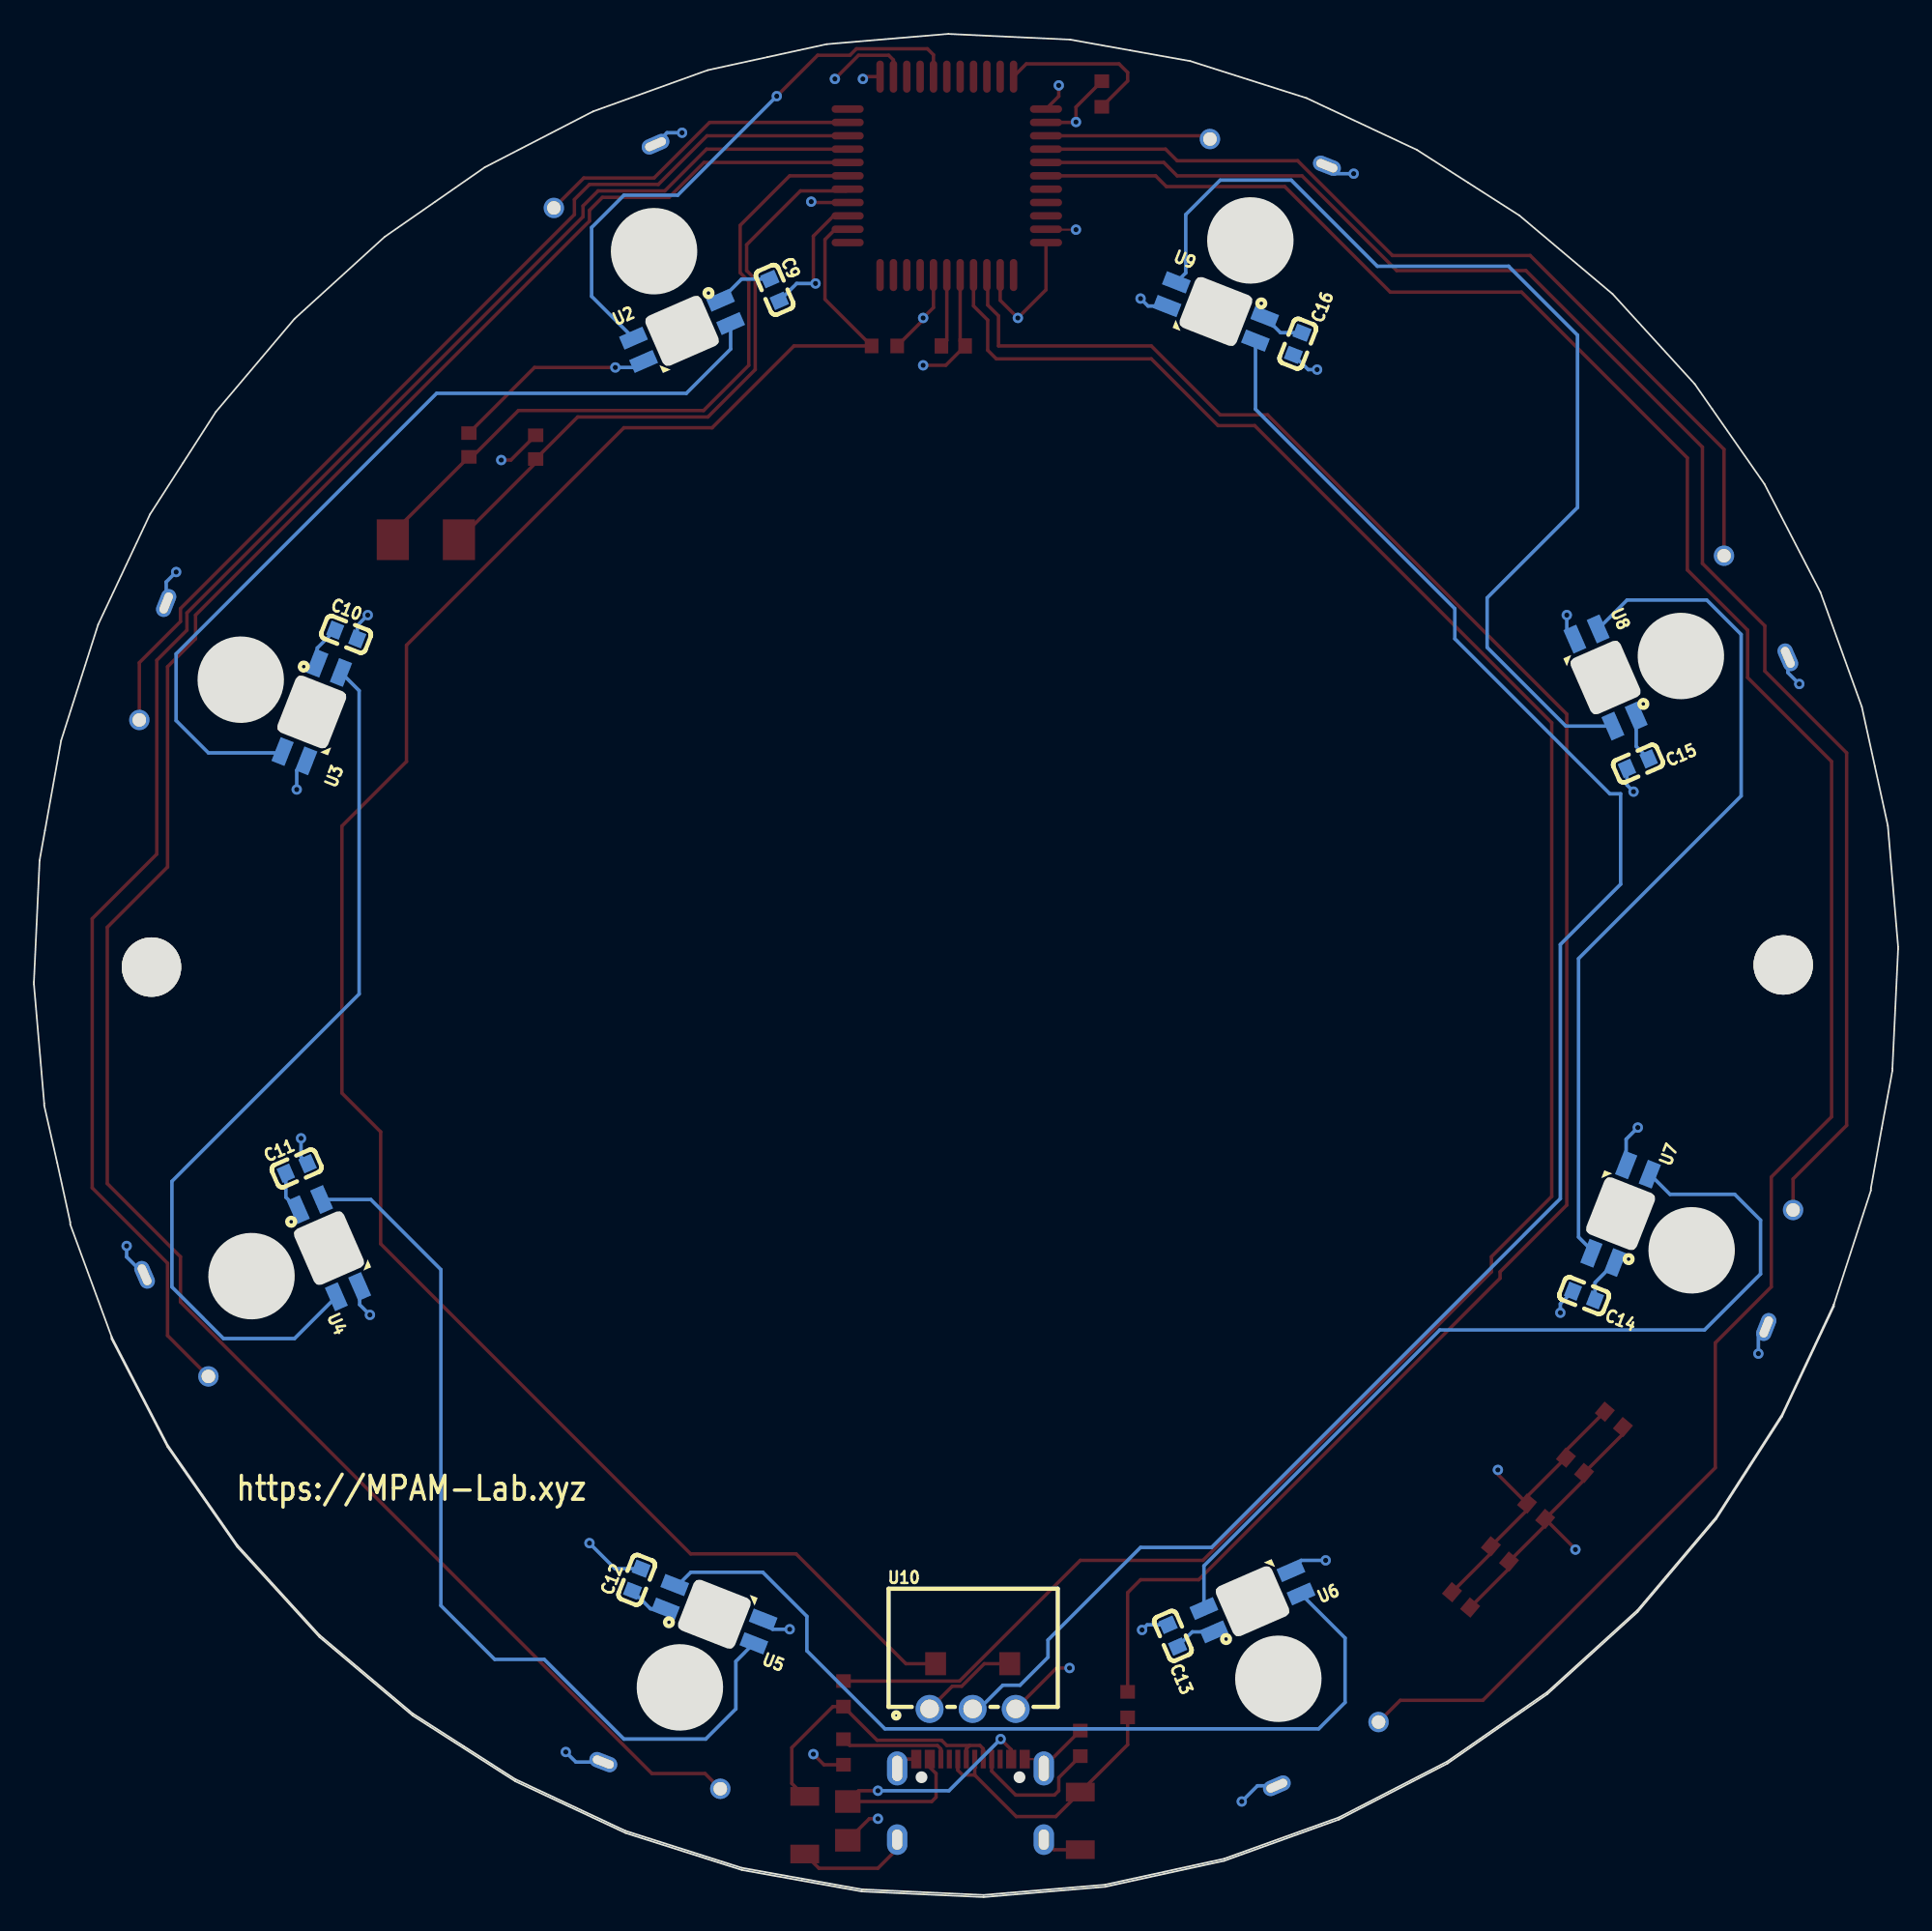
[diagram p5: board, bottom side, seen from below]

Outline 109.98 x 109.89 mm; copper layers: Top Layer, GND, VCC, Bottom Layer. Coordinates in mm from the lower left corner of the outline.
Outline path: 3.79,34.96 1.6,41.68 1.6,41.8 0.97,45.34 0.33,48.75 0.33,48.87 0,55.92 0,56.05 0.61,63.2 1.37,66.71 2.14,70.22 4.58,76.97 7.89,83.35 12,89.24 16.84,94.55 22.34,99.18 25.37,101.12 28.39,103.06 34.91,106.11 41.76,108.29 45.3,108.92 48.84,109.56 56.03,109.89 63.2,109.29 66.71,108.52 70.23,107.75 76.99,105.32 83.38,102.02 86.34,99.97 89.29,97.92 94.61,93.08 99.25,87.6 101.19,84.58 103.13,81.55 106.19,75.05 108.38,68.21 109.65,61.14 109.98,53.97 109.98,53.85 109.37,46.82 109.37,46.69 108.61,43.31 107.84,39.8 107.84,39.68 105.4,33.05 ; 3.79,34.96 3.79,34.84 6.85,28.34 10.73,22.3 15.37,16.81 20.69,11.97 26.6,7.87 32.99,4.57 39.75,2.14 46.78,0.61 53.95,0 61.14,0.33 68.22,1.6 75.07,3.78 81.59,6.83 87.64,10.71 93.14,15.34 97.98,20.65 102.09,26.54 105.4,32.92 105.4,33.05 ; 3.79,34.96 6.85,28.46 8.79,25.44 10.73,22.42 15.37,16.93 20.69,12.1 23.64,10.05 26.6,8 32.99,4.7 39.75,2.26 43.27,1.5 46.78,0.73 53.95,0.12 61.14,0.46 64.68,1.09 68.22,1.73 75.07,3.91 81.59,6.96 84.61,8.9 87.64,10.83 93.14,15.47 97.98,20.77 100.04,23.72 102.09,26.67 105.4,33.05
Stack: Top Layer 0.035mm 外层铜厚1oz / Dielectric1 0.2104mm 7628 RC49% 8.6mil / GND 0.0152mm 内层铜厚 / Dielectric2 1.065mm 1.1mm H/HOZ 含铜 / VCC 0.0152mm 内层铜厚 / Dielectric3 0.2104mm 7628 RC49% 8.6mil / Bottom Layer 0.035mm 外层铜厚1oz

## Design rules (mm)
template: JLCPCB Capability(Two Layers Board)
spacing copperThickness1oz (default): track to track 0.102, other pairs 0.152 to 0.3
spacing copperThickness2oz: track to track 0.203, other pairs 0.152 to 0.3
track width copperThickness1oz (default): min 0.127, default 0.254, max 2.54
track width copperThickness2oz: min 0.203, default 0.254, max 2.54
differential pair differentialPair (default): width min 0.127, default 0.254, max 2.54; gap min 0.152, default 0.152
via viaSize (default): diameter min 0.5, default 0.61, max 10; hole min 0.3, default 0.305, max 6.3

## Placement (name value [footprint] x y rotation side)
C1  1uF  [C0603]  55.74 91.49 0 top
C2  22pF  [C0603]  84.32 85.65 270 top
C3  22pF  [C0603]  80.38 85.52 270 top
C4  100nF  [C0603]  16.77 28.18 40.3 top
C5  100nF  [C0603]  19.06 25.47 40.3 top
C6  100nF  [C0603]  21.35 22.76 40.3 top
C7  100nF  [C0603]  23.49 20.24 40.3 top
C8  470nF  [C0603]  25.78 17.53 40.3 top
C9  100nF  [C0603]  66.28 94.79 246.5 bottom
C10  100nF  [C0603]  91.56 74.47 201.5 bottom
C11  100nF  [C0603]  94.48 42.98 156.4 bottom
C12  100nF  [C0603]  74.41 18.72 111.4 bottom
C13  100nF  [C0603]  42.79 15.42 66.5 bottom
C14  100nF  [C0603]  18.53 35.48 21.5 bottom
C15  100nF  [C0603]  15.35 66.85 336.4 bottom
C16  100nF  [C0603]  35.42 91.62 291.4 bottom
D1  ZMM3V6  [LL-34_L3.5-W1.5-RD]  64.5 4.24 270 top
D2  ZMM3V6  [LL-34_L3.5-W1.5-RD]  48.25 4.49 270 top
F1  2.5A/32VFUSESMD0805  [F0805]  61.96 4.49 90 top
NOREF  -  [Pad_e406]  103.04 54.85 0 top
NOREF#2  -  [Pad_e405]  6.78 54.98 0 top
R1  10kΩ  [R0603]  59.81 91.49 0 top
R2  10kΩ  [R0603]  46.98 106.35 90 top
R3  22Ω  [R0603]  62.22 11.99 270 top
R4  22Ω  [R0603]  45.45 11.35 270 top
R5  5.1kΩ  [R0603]  48.25 9.07 270 top
R6  5.1kΩ  [R0603]  62.22 8.56 90 top
SW1  TS-1088-AR02016  [SW-SMD_L3.9-W3.0-P4.45]  54.6 13.77 180 top
SW2  佳达隆矮轴_焊接  [佳达隆矮轴焊接]  73.39 97.08 336.5 top
SW3  佳达隆矮轴_焊接  [佳达隆矮轴焊接]  97.78 71.8 291.5 top
SW4  佳达隆矮轴_焊接  [佳达隆矮轴焊接]  97.14 36.63 246.4 top
SW5  佳达隆矮轴_焊接  [佳达隆矮轴焊接]  71.87 12.37 201.4 top
SW6  佳达隆矮轴_焊接  [佳达隆矮轴焊接]  36.56 12.88 156.5 top
SW7  佳达隆矮轴_焊接  [佳达隆矮轴焊接]  12.18 38.15 111.5 top
SW8  佳达隆矮轴_焊接  [佳达隆矮轴焊接]  12.81 73.2 66.4 top
SW9  佳达隆矮轴_焊接  [佳达隆矮轴焊接]  38.22 97.71 21.4 top
U1  ATMEGA32U4-AU  [QFP-44_L10.0-W10.0-P0.80-LS13.2-BL]  56.12 101.52 0 top
U2  WS2812B-3528幻彩反贴  [LED-SMD_L3.2-W2.8-TR]  71.74 92.38 156.5 bottom
U3  WS2812B-3528幻彩反贴  [LED-SMD_L3.2-W2.8-TR]  93.59 69.9 111.5 bottom
U4  WS2812B-3528幻彩反贴  [LED-SMD_L3.2-W2.8-TR]  92.57 38.28 66.4 bottom
U5  WS2812B-3528幻彩反贴  [LED-SMD_L3.2-W2.8-TR]  69.84 16.69 21.4 bottom
U6  WS2812B-3528幻彩反贴  [LED-SMD_L3.2-W2.8-TR]  38.09 17.45 336.5 bottom
U7  WS2812B-3528幻彩反贴  [LED-SMD_L3.2-W2.8-TR]  16.37 40.31 291.5 bottom
U8  WS2812B-3528幻彩反贴  [LED-SMD_L3.2-W2.8-TR]  17.26 71.93 246.4 bottom
U9  WS2812B-3528幻彩反贴  [LED-SMD_L3.2-W2.8-TR]  40.25 93.52 201.4 bottom
U10  XH2.54-WI-3P  [CONN-TH_XH2.54-WI-3P]  54.6 11.1 180 bottom
USB1  TYPE-C 16PIN 2MD(073)  [USB-C-SMD_TYPE-C-6PIN-2MD-073]  54.72 5.76 0 top
X1  -  [OSC-SMD_2P-L5.0-W3.2]  86.86 80.06 0 top

## Footprints (pads in the part's own frame, mm; a bottom-side part is the same pattern mirrored in y, then rotated)
C0603
  rect 0.8x0.9 smd: 1(-0.7,0) 2(0.7,0)
CONN-TH_XH2.54-WI-3P
  round 1.65 hole 1.1: 1(-2.54,0) 2(0,0) 3(2.54,0)
F0805
  rect 1.335x1.5 smd: 1(-1.143,0) 2(1.143,0)
LED-SMD_L3.2-W2.8-TR
  rect 1.5x0.82 smd: 1(2.8,0.75) 2(2.8,-0.75) 3(-2.8,-0.75) 4(-2.8,0.75)
LL-34_L3.5-W1.5-RD
  rect 1.1x1.7 smd: 1(-1.7,0) 2(1.7,0)
OSC-SMD_2P-L5.0-W3.2
  rect 1.9x2.4 smd: 1(-1.95,0) 2(1.95,0)
Pad_e405
  round 3.5 hole 3.5: 13(0,0)
Pad_e406
  round 3.5 hole 3.5: 14(0,0)
QFP-44_L10.0-W10.0-P0.80-LS13.2-BL
  oval 0.441x1.895 smd: 1(-3.937,-5.851) 2(-3.15,-5.851) 3(-2.362,-5.851) 4(-1.575,-5.851) 5(-0.787,-5.851) 6(0,-5.851) 7(0.787,-5.851) 8(1.575,-5.851) 9(2.362,-5.851) 10(3.15,-5.851) 11(3.937,-5.851) 23(3.937,5.851) 24(3.15,5.851) 25(2.362,5.851) 26(1.575,5.851) 27(0.787,5.851) 28(0,5.851) 29(-0.787,5.851) 30(-1.575,5.851) 31(-2.362,5.851) 32(-3.15,5.851) 33(-3.937,5.851)
  oval 1.895x0.441 smd: 12(5.851,-3.937) 13(5.851,-3.15) 14(5.851,-2.362) 15(5.851,-1.575) 16(5.851,-0.787) 17(5.851,0) 18(5.851,0.787) 19(5.851,1.575) 20(5.851,2.362) 21(5.851,3.15) 22(5.851,3.937) 34(-5.851,3.937) 35(-5.851,3.15) 36(-5.851,2.362) 37(-5.851,1.575) 38(-5.851,0.787) 39(-5.851,0) 40(-5.851,-0.787) 41(-5.851,-1.575) 42(-5.851,-2.362) 43(-5.851,-3.15) 44(-5.851,-3.937)
R0603
  rect 0.806x0.864 smd: 1(-0.753,0) 2(0.753,0)
SW-SMD_L3.9-W3.0-P4.45
  rect 1.23x1.36 smd: 1(-2.185,0) 2(2.185,0)
USB-C-SMD_TYPE-C-6PIN-2MD-073
  rect 0.6x1.1 smd: 1(-3.2,2.375) 2(-2.4,2.375) 11(2.4,2.375) 12(3.2,2.375)
  rect 0.3x1.1 smd: 3(-1.75,2.375) 4(-1.25,2.375) 5(-0.75,2.375) 6(-0.25,2.375) 7(0.25,2.375) 8(0.75,2.375) 9(1.25,2.375) 10(1.75,2.375)
  oval 1.2x2 hole 0.6x1.5: 13(-4.325,1.825) 14(4.325,1.825)
  oval 1.2x1.8 hole 0.6x1.2: 13(-4.325,-2.375) 14(4.325,-2.375)
佳达隆矮轴焊接
  oval 1.7x0.9 hole 1.3x0.5: 1(-2.6,5.75)
  round 1.2 hole 0.8: 2(4.4,4.7)

## Nets
As in the schematic.

Pads without a net: NOREF 14; NOREF#2 13; U1 1 8 9 10 11 12 22 25 26 28 29 30 31 32 40 41 42; USB1 3 9

## Via types
v1: diameter 0.61, hole 0.305, Top Layer to Bottom Layer, 42 vias

## Routing (per net, layer and track width the routed paths; a pad name or vN(x,y) marks a point on that pad's centre or on a via; arc(x,y) is an arc through that point)
GND: length 101.8
  Top Layer w0.127: USB1.1 50.95,8.14 USB1.13 ; v1(48.5,98.35) 50.25,98.35 U1.43
  Top Layer w0.203: U1.35 48.53,104.67 v1(48.5,104.7) 48.5,105.58 R2.2 ; U1.15 64.07,99.95 v1(64.12,100) ; USB1.13 50.4,7.67 R5.1 ; U10.1 55.8,12.44 55.24,12.44 53.91,13.77 SW1.2 ; D1.2 63.66,1.7 60.19,1.7 59.05,2.84 USB1.14 ; C3.1 81.84,84.76 v1(82.41,84.76) ; v1(61.07,107.24) 60.94,107.37 U1.23 ; v1(75.68,90.22) 80.44,90.22 C2.1 ; 20.82,22.31 20.82,21.92 C7.1 22.95,19.37 25.25,17.08 ; 20.82,22.31 19.04,20.52 v1(19.04,20.5) ; 20.82,22.31 18.53,24.6 C5.1 16.23,27.31 C4.1 ; R6.1 63.37,7.8 v1(64,8.43) ; USB1.13 49.81,2.79 D2.2 ; USB1.12 58.5,8.14 USB1.14 ; v1(57.52,90.35) 56.18,90.35 C1.1 55.33,91.78 U1.5
  Bottom Layer w0.203: v1(15.35,45.39) 16.04,44.7 16.04,43.19 ; SW5.1 78,7.96 v1(78.6,8.56) ; U3.3 94.48,66.46 v1(94.48,65.33) ; v1(8.24,32.05) 8.24,33.16 SW7.1 ; SW4.1 104.51,37.76 v1(104.51,38.4) ; U2.3 74.36,90.22 v1(75.68,90.22) ; 6.5,73.12 6.5,72.23 v1(5.83,71.55) ; U9.3 44.25,93.84 v1(44.69,94.28) ; 19.07,74.2 19.55,74.67 v1(19.55,75.61) ; v1(90.16,34.34) 90.76,34.94 U4.3 ; v1(65.39,15.8) 66.39,15.8 U5.3 ; v1(101.59,78.15) 102.18,77.56 SW3.1 ; 36.65,6.57 37.79,6.57 v1(38.72,5.64) ; v1(71.74,104.06) 72.63,104.06 73.31,103.39 ; SW9.1 33.23,101.65 v1(32.12,101.65) ; v1(33.77,19.86) 35.21,19.86 U6.3
VCC: length 65
  Top Layer w0.203: U1.7 56.91,93.75 v1(57.52,93.14) 57.52,93.02 R1.1 ; C6.2 23.61,24.94 v1(23.61,25.2) ; C6.2 21.89,22.83 24.02,20.69 24.02,20.28 C8.2 ; C6.2 21.89,23.63 19.59,25.92 19.59,26.34 C4.2 ; U1.44 50.27,94.8 v1(51.93,93.14) 52.97,94.18 U1.2 ; v1(62.73,107.24) 61.33,108.63 59.55,108.63 59.27,108.35 U1.24 ; v1(60.19,4.62) 60.69,4.62 F1.1 ; v1(48.88,13.51) 49.64,13.51 U10.3 ; v1(49.52,106.86) 49.52,106.21 U1.34 ; U1.14 62.8,99.16 64,97.97 64,95.3 v1(63.87,95.17)
  Bottom Layer w0.203: v1(77.2,20.88) 75.7,19.37 C12.2 ; v1(34.28,90.09) 34.8,90.09 C16.2 ; C9.2 64.98,95.17 v1(63.87,95.17) ; C15.2 16,65.59 v1(15.61,65.2) ; v1(90.28,75.61) 90.9,75 C10.2 ; C11.2 94.22,43.64 v1(94.22,44.75) ; v1(19.93,34.47) 19.93,34.99 19.18,35.74 ; C13.2 44.3,16.06 v1(44.61,15.76)
1: length 9.8
  Top Layer w0.203: SW9.2 40.79,103.88 U1.36
2: length 138.1
  Top Layer w0.203: SW5.2 70.39,7.29 73.52,7.29 101.33,35.1 101.33,37.77 105.65,42.09 105.65,57.2 102.1,60.76 102.1,72.57 100.44,74.22 100.44,75.61 77.2,98.86 77.2,99.49 76.44,100.25 72.5,100.25 70.45,102.31 U1.18
3: length 19.4
  Top Layer w0.203: U1.21 70.12,104.67 73.39,101.4 77.54,101.4 SW2.2
4: length 136.7
  Top Layer w0.203: U1.39 43.8,101.52 43.17,100.89 36.18,100.89 29.96,94.66 22.21,94.66 12.43,84.89 12.43,78.28 8.88,74.73 8.88,71.93 3.92,66.98 3.92,46.02 7.48,42.47 7.48,35.99 10.78,32.69 10.78,25.32 24.5,11.61 29.37,11.61 30.65,10.32
5: length 59
  Top Layer w0.203: SW3.2 103.76,72.81 101.33,75.23 101.33,76 78.09,99.24 78.09,100.13 77.2,101.01 73.14,101.01 70.27,103.88 U1.20
6: length 95.5
  Top Layer w0.203: U1.38 43.32,102.31 42.53,101.52 35.17,101.52 29.58,95.93 21.96,95.93 11.54,85.52 11.54,78.66 7.86,74.98 7.86,72.31 3.04,67.49 3.04,45.52 6.2,42.35 SW7.2
7: length 100.9
  Top Layer w0.203: SW4.2 102.1,33.12 102.1,37.39 106.54,41.83 106.54,57.71 102.73,61.52 102.73,72.95 100.95,74.73 100.95,75.74 77.59,99.11 77.59,99.74 76.7,100.63 72.76,100.63 70.29,103.1 U1.19
8: length 53.6
  Top Layer w0.203: U1.37 43.22,103.1 42.53,102.41 35.42,102.41 29.83,96.82 21.7,96.82 10.27,85.39 SW8.2
D+: length 117.4
  Top Layer w0.203: R4.1 45.45,17.96 44.69,18.72 41.26,18.72 23.48,36.5 23.48,36.88 19.55,40.82 19.55,69.77 37.2,87.43 39.99,87.43 44.06,91.49 53.07,91.49 53.07,93.27 53.71,93.9 53.71,95.62 U1.3
D-: length 129.2
  Top Layer w0.203: R3.1 55.37,12.74 48.25,19.86 41.01,19.86 23.99,36.88 23.99,37.77 20.43,41.32 20.43,69.26 37.96,86.79 40.12,86.79 44.06,90.73 53.2,90.73 53.71,91.24 53.71,93.01 54.55,93.85 U1.4
DOUT: length 109.1
  Bottom Layer w0.203: 37.91,91.8 37.91,87.76 26.15,76 26.15,74.22 17.01,65.07 16.37,65.07 16.37,59.74 19.93,56.18 19.93,41.2 40.5,20.62 44.69,20.62 50.15,15.16 50.15,14.15 51.8,12.5 52.82,12.5 54.22,11.1 U10.2
LED: length 33.5
  Top Layer w0.203: U1.27 56.91,108.66 57.26,109.02 61.46,109.02 61.84,108.63 63.74,108.63 v1(66.16,106.22)
  Bottom Layer w0.203: U2.4 77.08,94.41 77.08,98.47 75.17,100.38 72,100.38 v1(66.16,106.22)
$1N992: length 41.5
  Top Layer w0.203: X1.2 88.81,80.46 C2.2 84.13,84.95 81.39,87.68 70.47,87.68 67.81,90.35 67.81,95.3 68.31,95.81 68.31,98.6 65.39,101.52 U1.17
$1N1040: length 36.7
  Top Layer w0.203: U1.16 62.07,100.63 64.76,100.63 67.93,97.46 67.93,95.93 67.42,95.43 67.42,90.09 70.22,87.3 77.9,87.3 C3.2 80.38,84.59 X1.1
$1N1214: length 124.6
  Top Layer w0.203: U1.13 62.7,98.37 63.31,97.76 63.31,94.24 R1.2 65.14,91.49 69.97,86.66 75.17,86.66 88,73.84 88,66.98 91.81,63.17 91.81,47.42 89.52,45.13 89.52,38.53 71.23,20.24 65.01,20.24 58.53,13.77 SW1.1
$1N1318: length 9.9
  Top Layer w0.203: R2.1 45.45,107.12 45.45,107.62 45.96,108.13 51.43,108.13 52.19,107.37
$1N2823: length 19.7
  Top Layer w0.203: USB1.11 57.12,7.66 56.76,7.29 56.76,5.89 57.01,5.64 F1.2 61.33,6.27 v1(60.19,6.27) ; USB1.2 52.32,8.7 v1(52.95,9.32)
  Bottom Layer w0.203: v1(60.19,6.27) 56,6.27 v1(52.95,9.32)
$1N3423: length 18
  Top Layer w0.203: 54.77,8.94 54.17,8.94 53.97,8.75 USB1.5 ; 54.77,8.94 56.13,8.94 56.43,9.25 60.23,9.25 R3.2 62.84,11.23 65.27,8.81 65.27,6.7 64.5,5.94 ; 54.77,8.94 54.97,8.74 USB1.7
$1N3438: length 16.1
  Top Layer w0.203: 54.47,7.2 USB1.6 ; 54.47,7.2 55.19,7.2 55.47,7.49 USB1.8 ; 54.47,7.2 52.02,4.75 49.69,4.75 D2.1 45.45,8.99 R4.2
$1N3472: length 7.9
  Top Layer w0.203: R5.2 49.52,7.04 49.52,6.27 49.77,6.02 52.06,6.02 53.47,7.44 USB1.4
$1N3479: length 6.6
  Top Layer w0.203: USB1.10 56.47,8.74 56.68,8.94 61.85,8.94 R6.2
$1N3933: length 52.7
  Bottom Layer w0.203: U3.4 95.39,67.49 99.68,67.49 101.59,69.39 101.59,73.33 86.22,88.7 71.49,88.7 68.88,91.31 U2.2
$1N3938: length 53.3
  Bottom Layer w0.203: 92.14,35.41 94.6,32.94 98.79,32.94 101.84,35.99 101.84,42.21 90.79,53.26 90.79,71.16 U3.2
$1N3943: length 54.3
  Bottom Layer w0.203: U4.2 90.1,41.14 85.97,37.01 85.97,17.19 82.79,14.02 79.87,14.02 75.17,9.32 70.35,9.32 68.57,11.1 68.57,13.9 U5.4
$1N3948: length 53
  Bottom Layer w0.203: U6.4 32.63,15.28 32.63,11.48 34.18,9.93 59.78,9.93 64.38,14.53 64.38,16.56 66.98,19.16 71.22,19.16 71.98,18.41 U5.2
$1N3953: length 53.3
  Bottom Layer w0.203: U7.4 13.46,41.45 9.64,41.45 8.12,39.93 8.12,36.75 11.42,33.45 27.04,33.45 40.95,19.53 U6.2
$1N3959: length 50.8
  Bottom Layer w0.203: U8.4 15.99,76.5 11.29,76.5 9.26,74.47 9.26,64.95 18.85,55.35 18.85,38.93 18.09,38.17 U7.2
$1N3965: length 61.9
  Bottom Layer w0.203: 42.58,95.24 42.03,95.8 42.03,99.24 39.99,101.27 35.8,101.27 30.72,96.19 22.97,96.19 18.91,92.12 18.91,81.96 24.24,76.63 24.24,73.71 19.6,69.07 U8.2
$1N4279: length 3.4
  Bottom Layer w0.203: 69.48,94.18 68.23,95.43 C9.1
$1N4296: length 2.4
  Bottom Layer w0.203: C10.1 93.26,73.67 93.26,72.78
$1N4306: length 2.5
  Bottom Layer w0.203: C11.1 95.12,41.28 U4.1
$1N4316: length 2.4
  Bottom Layer w0.203: 74.66,18.07 73.61,17.01 U5.1
$1N4320: length 2.5
  Bottom Layer w0.203: 42.51,14.77 41.64,15.64 40.36,15.64
$1N4353: length 2.6
  Bottom Layer w0.203: 35.17,92.27 36.44,92.27 U9.1
$1N4416: length 2.7
  Bottom Layer w0.203: U7.1 17.88,36.25 C14.1
$1N4551: length 2.8
  Bottom Layer w0.203: C15.1 15.45,67.87 15.45,69.67
$1N4867: length 4.3
  Top Layer w0.203: U1.6 56.12,91.81 56.44,91.49

## Copper pours and planes (outline as drawn; the poured copper is in the pictures)
GND on GND: 0.26,109.64 109.72,109.64 109.72,0.38 0.26,0.38
VCC on VCC: 0.26,109.64 109.72,109.64 109.72,0.38 0.26,0.38

Small or netless copper shapes (teardrops, artwork), in the pictures only: 52 on GND, 4 on VCC

## Text on the board
Bottom Silkscreen Layer: https://MPAM-Lab.xyz
Top Silkscreen Layer: TM | @nonefffds | FDS | Circuller | Rev 1.1f | MPAM / Laboratory
